# Altium project EL2086.PrjPcb (part 2 of 3)

## Sheet BOOT_JTAG_AUX.SchDoc: =project_title
size Tabloid; CompanyName: Luxonis Holding; DrawnBy: Eason Lin; Organization: Luxonis Holding; Address1: 1925 Harmony Park Drive; Address2: Westminster, CO; Address3: 80234; Address4: United States; DocumentNumber: D2088000; Revision: R0M0E0; SheetNumber: 7; SheetTotal: 14
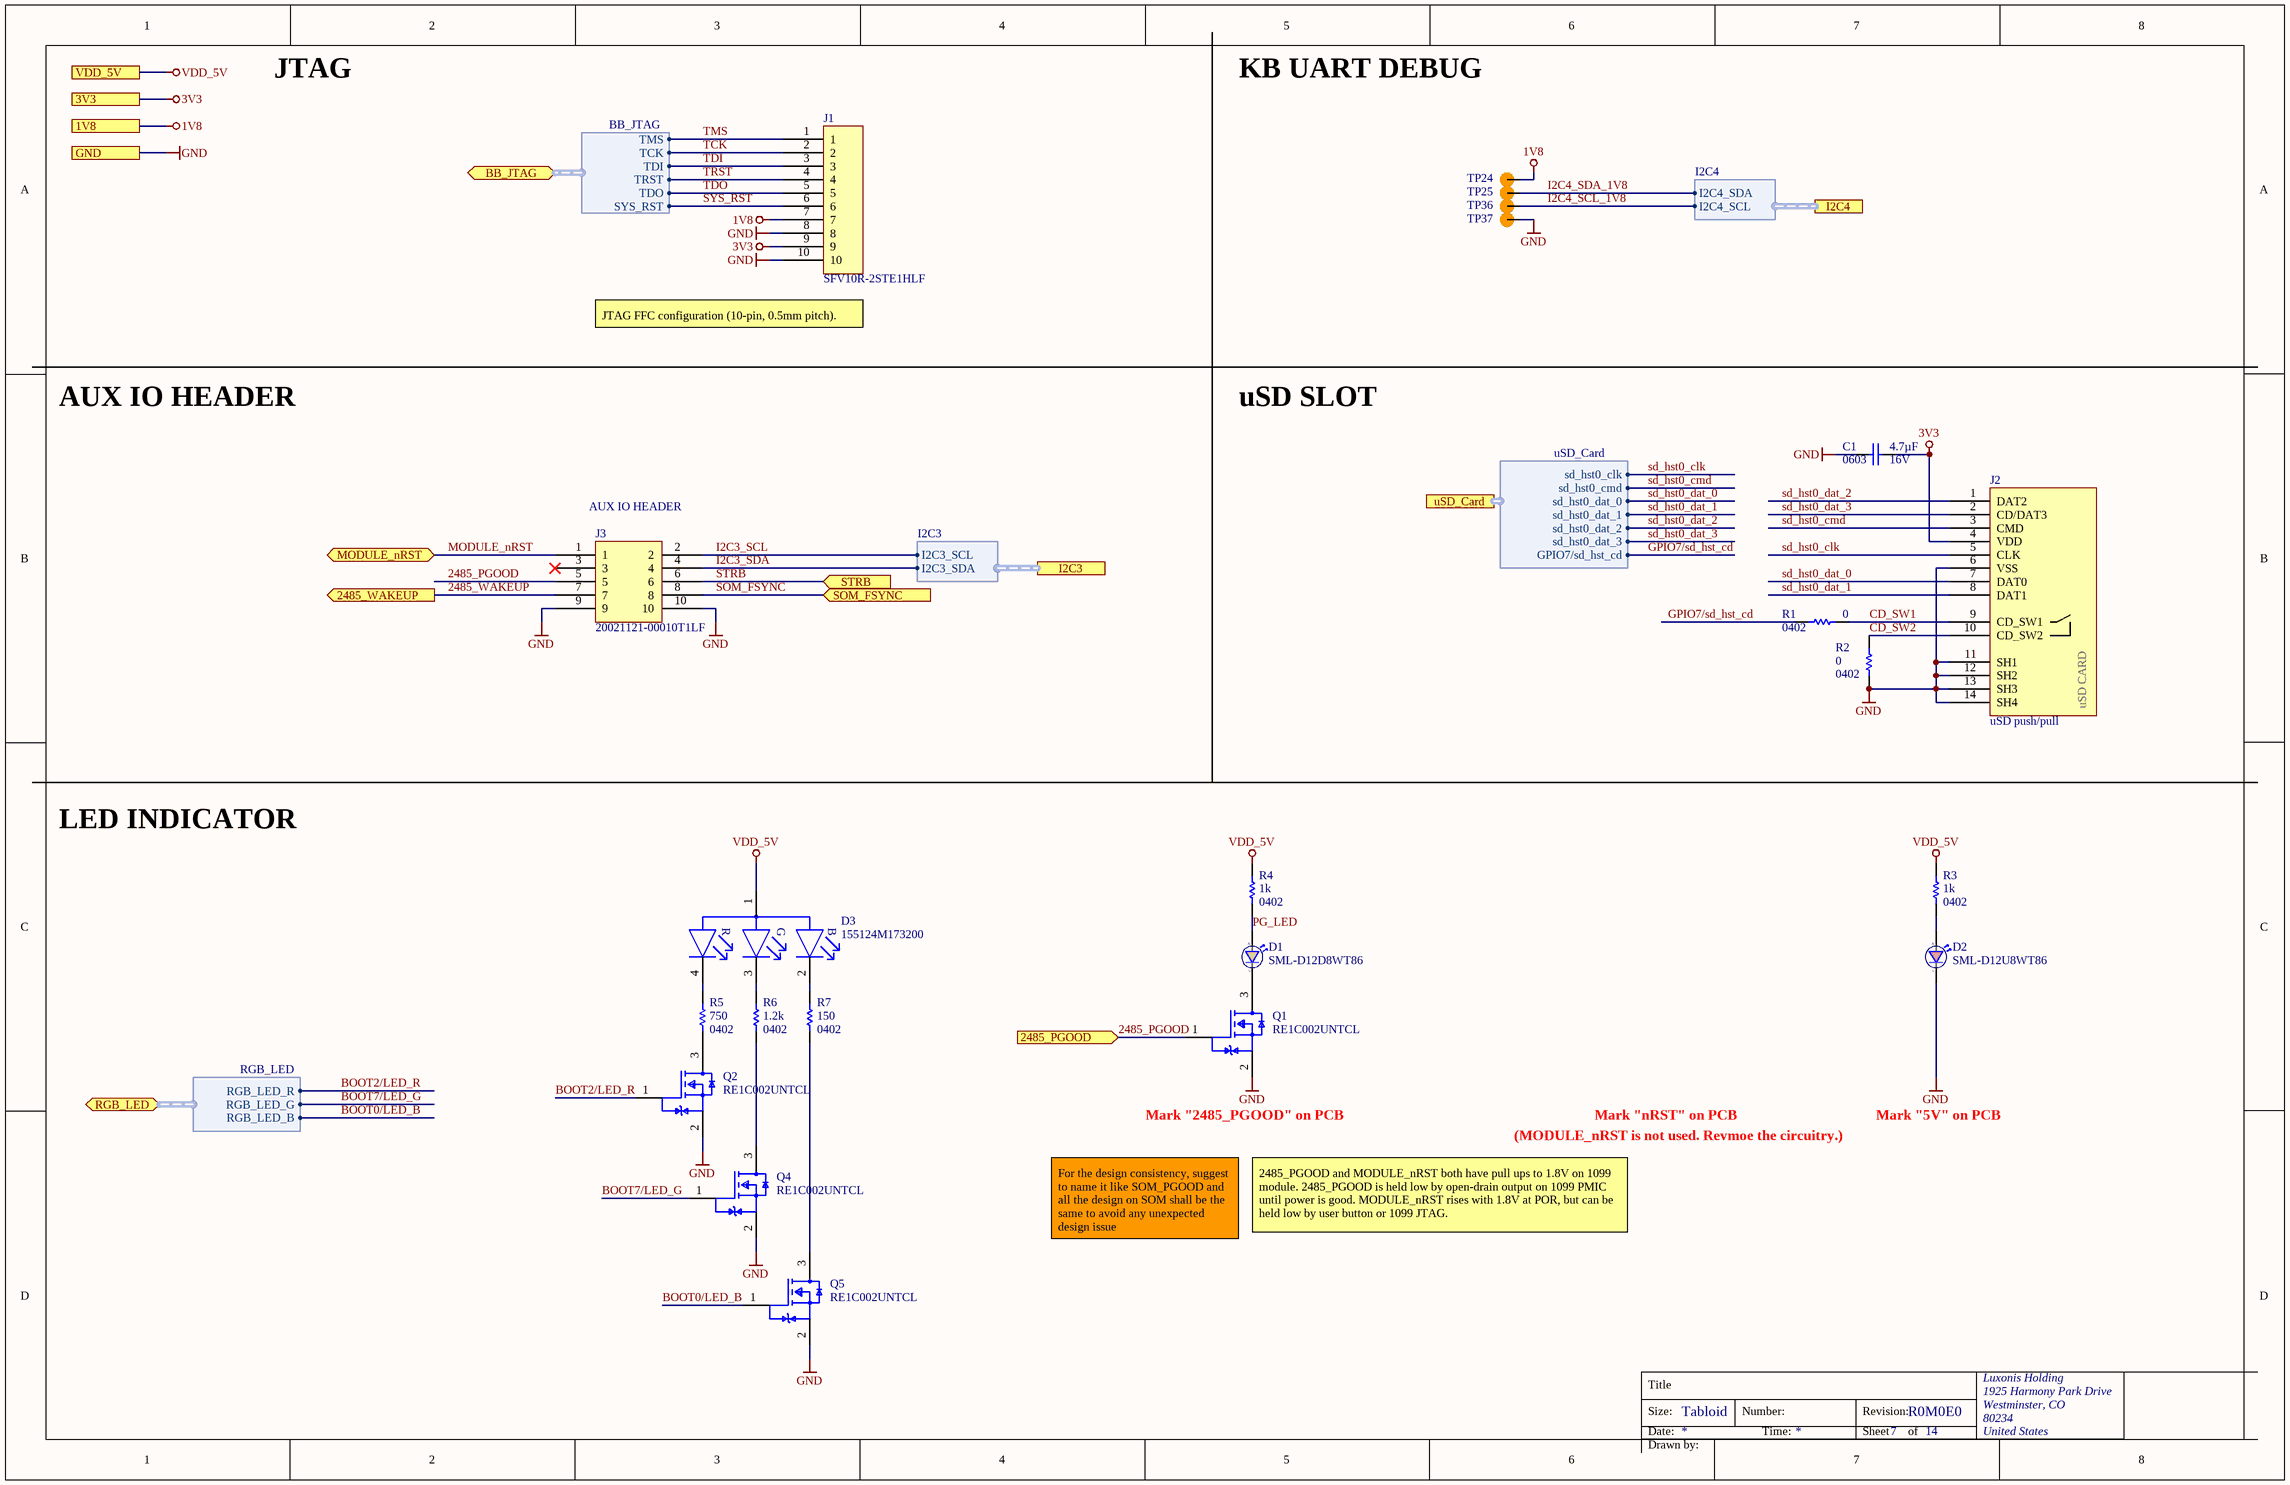
[diagram p5: BOOT_JTAG_AUX.SchDoc]

### Parts
C1  value 4.7µF  Voltage Rating: 16V  Case/Package: 0603  [CAPC0603(1608)100_N]  (hidden comment: GRM188R61C475KAAJD)
D1  SML-D12D8WT86  [SML_D1xx8W]
D2  SML-D12U8WT86  [SML_D1xx8W]
D3  155124M173200  [FP-155124M173200-MFG]
J1  SFV10R-2STE1HLF  [SFV10R-2STE1HLF]
J2  uSD push/pull  [104031-0811]
J3  20021121-00010T1LF  [20021121-00010T1LF]
Q1  RE1C002UNTCL  [RE1C002UNTCL]
Q2  RE1C002UNTCL  [RE1C002UNTCL]
Q4  RE1C002UNTCL  [RE1C002UNTCL]
Q5  RE1C002UNTCL  [RE1C002UNTCL]
R1  value 0  Case/Package: 0402  [RESC0402(1005)_L]  (hidden comment: CRCW04020000Z0ED)
R2  value 0  Case/Package: 0402  [RESC0402(1005)_L]  (hidden comment: CRCW04020000Z0ED)
R3  value 1k  Case/Package: 0402  [RESC0402(1005)_L]  (hidden comment: RC0402FR-071KL)
R4  value 1k  Case/Package: 0402  [RESC0402(1005)_L]  (hidden comment: RC0402FR-071KL)
R5  value 750  Case/Package: 0402  [RESC1005X40X25NL05T05]  (hidden comment: ERJ-2RKF7500X)
R6  value 1.2k  Case/Package: 0402  [RESC1005X40X25NL05T05]  (hidden comment: CRCW04021K20FKED)
R7  value 150  Case/Package: 0402  [RESC1005X40X25NL05T10]  (hidden comment: RC0402FR-07150RL)
TP24  TEST_POINT  [TP075_150_NS]  (value not drawn)  (no BOM)
TP25  TEST_POINT  [TP075_150_NS]  (value not drawn)  (no BOM)
TP36  TEST_POINT  [TP075_150_NS]  (value not drawn)  (no BOM)
TP37  TEST_POINT  [TP075_150_NS]  (value not drawn)  (no BOM)

### Ports
1V8, 3V3, 2485_PGOOD (in), 2485_WAKEUP (out), BB_JTAG (bidir, harness BB_JTAG), GND, I2C3 (harness I2C3), I2C4 (harness I2C4), MODULE_nRST (bidir), RGB_LED (bidir, harness RGB_LED), SOM_FSYNC (in), STRB (in), uSD_Card (harness uSD_Card), VDD_5V

### Harnesses
BB_JTAG: TMS, TCK, TDI, TRST, TDO, SYS_RST
I2C3: I2C3_SDA, I2C3_SCL
uSD_Card: sd_hst0_clk, sd_hst0_cmd, sd_hst0_dat_0, sd_hst0_dat_1, sd_hst0_dat_2, sd_hst0_dat_3, GPIO7/sd_hst_cd
RGB_LED: RGB_LED_G, RGB_LED_B, RGB_LED_R
I2C4: I2C4_SDA, I2C4_SCL

### Nets
1V8: J1.7 TP24.1 ; port 1V8
3V3: C1.1 J1.9 J2.4(VDD) ; port 3V3
GND: C1.2 D2.1(C) J1.8 J1.10 J2.6(VSS) J2.11(SH1) J2.12(SH2) J2.13(SH3) J2.14(SH4) J3.9 J3.10 Q1.2(Source) Q2.2(Source) Q4.2(Source) Q5.2(Source) R2.1 TP37.1 ; port GND
VDD_5V: D3.1(COMMON_ANODE) R3.2 R4.2 ; port VDD_5V
2485_PGOOD: J3.5 Q1.1(Gate) ; port 2485_PGOOD
2485_WAKEUP: J3.7 ; port 2485_WAKEUP
BOOT0/LED_B: Q5.1(Gate) ; port RGB_LED.RGB_LED_B
BOOT2/LED_R: Q2.1(Gate) ; port RGB_LED.RGB_LED_R
BOOT7/LED_G: Q4.1(Gate) ; port RGB_LED.RGB_LED_G
CD_SW1: J2.9(CD_SW1) R1.2
CD_SW2: J2.10(CD_SW2) R2.2
GPIO7/sd_hst_cd: R1.1 ; port uSD_Card.GPIO7/sd_hst_cd
I2C3_SCL: J3.2 ; port I2C3.I2C3_SCL
I2C3_SDA: J3.4 ; port I2C3.I2C3_SDA
I2C4_SCL_1V8: TP36.1 ; port I2C4.I2C4_SCL
I2C4_SDA_1V8: TP25.1 ; port I2C4.I2C4_SDA
MODULE_nRST: J3.1 ; port MODULE_nRST
PG_LED: D1.2(A) R4.1
sd_hst0_clk: J2.5(CLK) ; port uSD_Card.sd_hst0_clk
sd_hst0_cmd: J2.3(CMD) ; port uSD_Card.sd_hst0_cmd
sd_hst0_dat_0: J2.7(DAT0) ; port uSD_Card.sd_hst0_dat_0
sd_hst0_dat_1: J2.8(DAT1) ; port uSD_Card.sd_hst0_dat_1
sd_hst0_dat_2: J2.1(DAT2) ; port uSD_Card.sd_hst0_dat_2
sd_hst0_dat_3: J2.2(CD/DAT3) ; port uSD_Card.sd_hst0_dat_3
SOM_FSYNC: J3.8 ; port SOM_FSYNC
STRB: J3.6 ; port STRB
SYS_RST: J1.6 ; port BB_JTAG.SYS_RST
TCK: J1.2 ; port BB_JTAG.TCK
TDI: J1.3 ; port BB_JTAG.TDI
TDO: J1.5 ; port BB_JTAG.TDO
TMS: J1.1 ; port BB_JTAG.TMS
TRST: J1.4 ; port BB_JTAG.TRST
NetD1_1: D1.1(C) Q1.3(Drain)
NetD2_2: D2.2(A) R3.1
NetD3_2: D3.2(BLUE_C) R7.2
NetD3_3: D3.3(GREEN_C) R6.2
NetD3_4: D3.4(RED_C) R5.2
NetQ2_3: Q2.3(Drain) R5.1
NetQ4_3: Q4.3(Drain) R6.1
NetQ5_3: Q5.3(Drain) R7.1

Not connected (* = marked no-connect by the designer): J3 3*

### Notes on the sheet
- JTAG
- KB UART DEBUG
- (near J1) JTAG FFC configuration (10-pin, 0.5mm pitch).
- AUX IO HEADER
- uSD SLOT
- (near J3) AUX IO HEADER
- LED INDICATOR
- Mark "2485_PGOOD" on PCB
- (MODULE_nRST is not used. Revmoe the circuitry.)
- Mark "nRST" on PCB
- Mark "5V" on PCB
- For the design consistency, suggest to name it like SOM_PGOOD and all the design on SOM shall be the same to avoid any unexpected design issue
- 2485_PGOOD and MODULE_nRST both have pull ups to 1.8V on 1099 module. 2485_PGOOD is held low by open-drain output on 1099 PMIC until power is good. MODULE_nRST rises with 1.8V at POR, but can be held low by user button or 1099 JTAG.
- Title
- Size:
- Date:
- Tabloid
- Number:
- Time:
- Revision:
- Sheet
- of
- Drawn by:
- (in symbol 104031-0811) uSD CARD
- (in symbol CMP-007-00038-2) R; G; B

### Library data of the parts
C1 = CMP-004-000020-4: CAP CER 4.7UF 16V X5R 0603 10%; Manufacturer 1: Murata; Max Operating Temperature: 85°C; Dielectric: X5R; Design Item ID: GRM188R61C475KAAJD; Depth: 0.8mm; Width: 0.8mm; Manufacturer 2: Murata; Manufacturer Part Number 3: GRM188R61C475KAAJD; Manufacturer Part Number 2: GRM188R61C475KAAJD; ComponentLink1Description: https://datasheet.ciiva.com/14813/595grm188r61c475kaaj23-14813668.pdf?src-supplier=Arrow; ComponentLink1URL: https://datasheet.ciiva.com/14813/595grm188r61c475kaaj23-14813668.pdf?src-supplier=Arrow; Manufacturer Part Number 1: GRM188R61C475KAAJD; Manufacturer 3: Murata; Mounting Technology: SMT; Tolerance: 10%; Length: 1.6mm; Min Operating Temperature: -55°C; Height: 0.8mm
D1 = CMP-111-000003-2: LED ORANGE DIFFUSED 0603 SMD Orange 605nm LED Indication - Discrete 2.2V 0603 (1608 Metric); Manufacturer 1: Rohm; Forward Current: 20mA; Case/Package: 0603; Manufacturer Part Number 1: SML-D12D8WT86; Max Operating Temperature: 85°C; Forward Voltage: 2.2V; Min Operating Temperature: -40°C; Color: Orange
D2 = CMP-111-000005-2: LED RED DIFFUSED 0603 SMD Red 620nm LED Indication - Discrete 2.2V 0603 (1608 Metric); Manufacturer 1: Rohm; Forward Current: 20mA; Manufacturer Part Number 1: SML-D12U8WT86; Case/Package: 0603; Forward Voltage: 2.2V; Min Operating Temperature: -40°C; Color: Red; Max Operating Temperature: 85°C
D3 = CMP-007-00038-2: Triple Color LED; Manufacturer 1: Wurth Elektronik; Max Current Rating: 30mA; Viewing Angle: 120°; Colour: RGB; Forward Current: 20mA; Case/Package: 1204; Manufacturer Part Number 1: 155124M173200
J1 = CMP-005-000024-3: CONN FFC TOP 10POS 0.50MM R/A; Manufacturer 1: Amphenol FCI; Pitch: 0.5mm; Voltage Rating: 50V; Gender: Female; Orientation: Right Angle; Max Operating Temperature: 105°C; Min Operating Temperature: -55°C; Mount: Surface Mount; Manufacturer Part Number 1: SFV10R-2STE1HLF; Pins: 10
J2 = 104031-0811: CONN MICRO SD CARD PUSH-PULL R/A; Manufacturer 1: Molex; Manufacturer Part Number 1: 104031-0811; Supplier 1: Digi-Key; Stock 1: 19400; Pricing 1: 1=2.02000, 10=1.82900, 25=1.71680, 50=1.64220, 100=1.56760, 250=1.41828, 500=1.30630, 1000=1.11969 (USD); RoHS: Yes; Supplier 2: Newark; Supplier 3: Mouser; Supplier Part Number 1: WM6357CT-ND; Supplier Part Number 2: 99R5410; Supplier Part Number 3: 538-104031-0811
J3 = 20021121-00010T1LF: CONN HEADER SMD 10POS 1.27MM; Manufacturer 1: Amphenol FCI; Number of Contacts: 10; Contact Resistance: 30mR; Max Voltage Rating (AC): 125V; Connector Type: Male Pin; Row Spacing: 0.05inch; Supplier 1: Digi-Key; Manufacturer Part Number 1: 20021121-00010T1LF; Stock 1: 1465; Pricing 1: 1=0.77000, 10=0.71800, 100=0.55040, 500=0.47860, 1000=0.39485, 5000=0.34699, 10000=0.32306 (USD); RoHS: Yes; Mount: Surface Mount; Contact Plating: Gold; Color: Black; Contact Material: Copper Alloy; Housing Color: Black; Housing Material: Thermoplastic; Min Operating Temperature: -40°C; Max Operating Temperature: 85°C; Number of Rows: 2; Termination: Solder; Package Quantity: 93; Packaging: Rail/Tube; Number of Positions: 10; Orientation: Straight; Length: 6.35mm; Pitch: 1.27mm; Contact Mating Length: 0.12inch; Depth: 3.4mm; ComponentLink1URL: https://datasheet.ciiva.com/18659/20021121-18659066.pdf?src-supplier=Digi-Key; ComponentLink1Description: https://datasheet.ciiva.com/18659/20021121-18659066.pdf?src-supplier=Digi-Key; ComponentLink2URL: https://datasheet.ciiva.com/10033/20021121-10033582.pdf?src-supplier=Avnet; ComponentLink2Description: https://datasheet.ciiva.com/10033/20021121-10033582.pdf?src-supplier=Avnet; Supplier Part Number 1: 609-6529-ND; Supplier 2: Mouser; Supplier 3: TTI; Supplier Part Number 2: 649-200211210010T1LF; Supplier Part Number 3: 20021121-00010T1LF
Q1 Q2 Q4 Q5 = CMP-120-000001-2: MOSFET N-CH 20V 0.2A EMT3; Manufacturer 1: Rohm; Continuous Drain Current: 200mA; Case/Package: SOT-89; Manufacturer Part Number 1: RE1C002UNTCL; Design Item ID: RE1C002UNTCL; Max Drain to Source Voltage: 20V
R1 R2 = CMP-013-000022-11: as R17 on sheet CONNECTOR_B; Max Operating Temperature: 155°C; Manufacturer Part Number 1: CRCW04020000Z0ED; Tolerance: 5%; Min Operating Temperature: -55°C; Design Item ID: CRCW04020000Z0ED
R3 R4 = CMP-013-000004-10: RES SMD 1K OHM 1% 1/16W 0402; Manufacturer 1: Yageo; Power Rating: 62.5mW; Voltage Rating: 50V; Min Operating Temperature: -55°C; Design Item ID: RC0402FR-071KL; Tolerance: 1%; Max Operating Temperature: 155°C; Manufacturer Part Number 1: RC0402FR-071KL
R5 = CMP-009-00197-8: RES SMD 750 OHM 1% 0.1W 0402; Manufacturer 1: Panasonic; Power Rating: 100mW; Manufacturer Part Number 1: ERJ-2RKF7500X; Tolerance: 1%
R6 = CMP-009-00198-15: RES SMD 1.2K OHM 1% 0.063W 0402; Manufacturer 1: Vishay; Voltage Rating: 50V; Power Rating: 63mW; Manufacturer Part Number 1: CRCW04021K20FKED; Tolerance: 1%
R7 = CMP-009-00196-8: RES SMD 150 OHM 1% 1/16W 0402; Manufacturer 1: Yageo; Voltage Rating: 50V; Tolerance: 1%; Manufacturer Part Number 1: RC0402FR-07150RL
TP24 TP25 TP36 TP37 = CMP-015-000000-2: Manufacturer Part Number 1: /; Source: LuxonisMaster.SchLib; Design Item ID: TEST_POINT

## Sheet POWER_GEN.SchDoc: =project_title
size Tabloid; CompanyName: Luxonis Holding; DrawnBy: Eason Lin; Organization: Luxonis Holding; Address1: 1925 Harmony Park Drive; Address2: Westminster, CO; Address3: 80234; Address4: United States; DocumentNumber: D2088000; Revision: R0M0E0; SheetNumber: 4; SheetTotal: 14
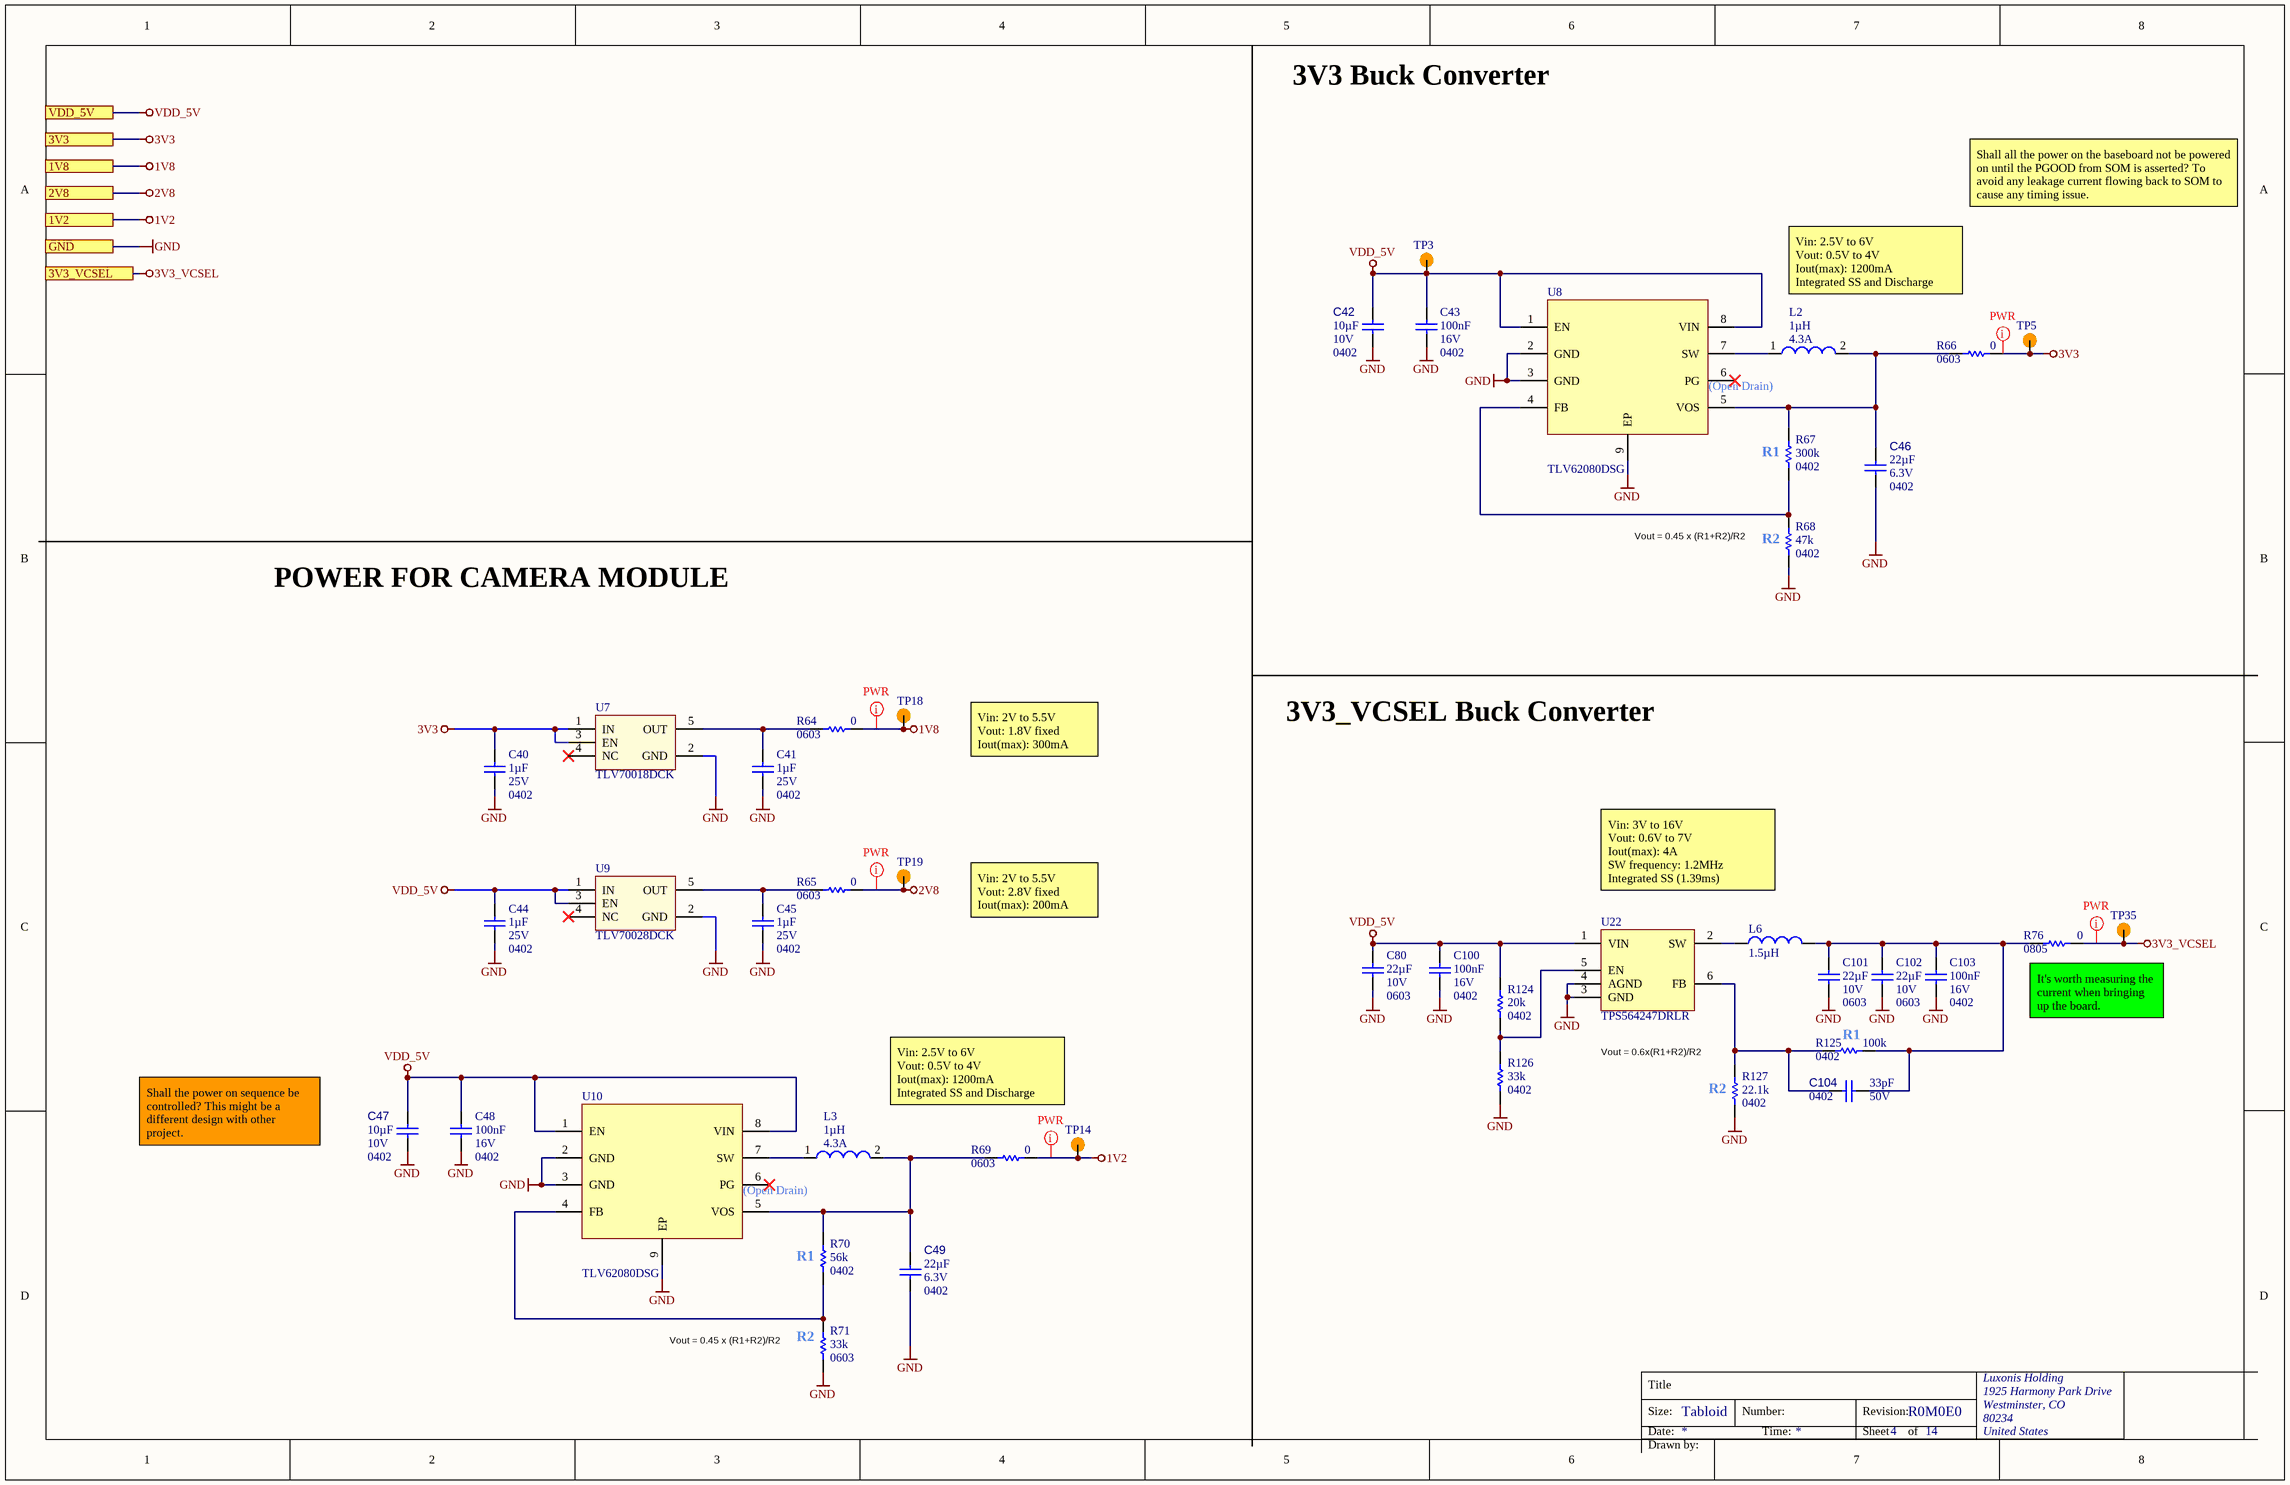
[diagram p6: POWER_GEN.SchDoc]

### Parts
C40  value 1µF  Voltage Rating: 25V  Case/Package: 0402  [CAPC0402(1005)70_N]  (hidden comment: GRM155R61E105KA12D)
C41  value 1µF  Voltage Rating: 25V  Case/Package: 0402  [CAPC0402(1005)70_N]  (hidden comment: GRM155R61E105KA12D)
C42  value 10µF  Voltage Rating: 10V  Case/Package: 0402  [CAPC0402(1005)60_L]  (hidden comment: GRM155R61A106ME11D)
C43  value 100nF  Voltage Rating: 16V  Case/Package: 0402  [CAPC0402(1005)60_N]  (hidden comment: CL05B104KO5NFNC)
C44  value 1µF  Voltage Rating: 25V  Case/Package: 0402  [CAPC0402(1005)70_N]  (hidden comment: GRM155R61E105KA12D)
C45  value 1µF  Voltage Rating: 25V  Case/Package: 0402  [CAPC0402(1005)70_N]  (hidden comment: GRM155R61E105KA12D)
C46  value 22µF  Voltage Rating: 6.3V  Case/Package: 0402  [CAPC0402(1005)60_L]  (hidden comment: CL05A226MQ5N6J8)
C47  value 10µF  Voltage Rating: 10V  Case/Package: 0402  [CAPC0402(1005)60_L]  (hidden comment: GRM155R61A106ME11D)
C48  value 100nF  Voltage Rating: 16V  Case/Package: 0402  [CAPC0402(1005)60_N]  (hidden comment: CL05B104KO5NFNC)
C49  value 22µF  Voltage Rating: 6.3V  Case/Package: 0402  [CAPC0402(1005)60_L]  (hidden comment: CL05A226MQ5N6J8)
C80  value 22µF  Voltage Rating: 10V  Case/Package: 0603  [CAPC0603(1608)100_N]  (hidden comment: GRM188R61A226ME15D)
C100  value 100nF  Voltage Rating: 16V  Case/Package: 0402  [CAPC0402(1005)60_N]  (hidden comment: CL05B104KO5NFNC)
C101  value 22µF  Voltage Rating: 10V  Case/Package: 0603  [CAPC0603(1608)100_N]  (hidden comment: GRM188R61A226ME15D)
C102  value 22µF  Voltage Rating: 10V  Case/Package: 0603  [CAPC0603(1608)100_N]  (hidden comment: GRM188R61A226ME15D)
C103  value 100nF  Voltage Rating: 16V  Case/Package: 0402  [CAPC0402(1005)60_N]  (hidden comment: CL05B104KO5NFNC)
C104  value 33pF  Voltage Rating: 50V  Case/Package: 0402  [FP-GCM155-0_05-IPC_A]  (hidden comment: GCM1555C1H330JA16D)
L2  value 1µH  Current Rating: 4.3A  [DFE252012P-1R0M=P2]  (hidden comment: DFE252012P-1R0M=P2)
L3  value 1µH  Current Rating: 4.3A  [DFE252012P-1R0M=P2]  (hidden comment: DFE252012P-1R0M=P2)
L6  value 1.5µH  [FP-SRP6540-MFG]  (hidden comment: SRP6540-1R5M)
R64  value 0  Case/Package: 0603  [RESC0603(1608)_N]  (hidden comment: CRCW06030000Z0EA)
R65  value 0  Case/Package: 0603  [RESC0603(1608)_N]  (hidden comment: CRCW06030000Z0EA)
R66  value 0  Case/Package: 0603  [RESC0603(1608)_N]  (hidden comment: CRCW06030000Z0EA)
R67  value 300k  Case/Package: 0402  [RESC0402(1005)_N]  (hidden comment: RC0402FR-07300KL)
R68  value 47k  Case/Package: 0402  [RESC0402(1005)_L]  (hidden comment: RC0402FR-0747KL)
R69  value 0  Case/Package: 0603  [RESC0603(1608)_N]  (hidden comment: CRCW06030000Z0EA)
R70  value 56k  Case/Package: 0402  [RESC0402(1005)_L]  (hidden comment: RC0402FR-0756KL)
R71  value 33k  Case/Package: 0603  [RESC1608X55X25LL10T15]  (hidden comment: RC0603FR-0733KL)
R76  value 0  Case/Package: 0805  [RESC0805(2012)_L]  (hidden comment: CRCW08050000Z0EA)
R124  value 20k  Case/Package: 0402  [RESC0402(1005)_L]  (hidden comment: RC0402FR-0720KL)
R125  value 100k  Case/Package: 0402  [RESC0402(1005)_L]  (hidden comment: RC0402FR-07100KL)
R126  value 33k  Case/Package: 0402  [RESC0402(1005)_L]  (hidden comment: CRCW040233K0FKED)
R127  value 22.1k  Case/Package: 0402  [RESC0402(1005)_N]  (hidden comment: RC0402FR-0722K1L)
TP3  TP075_150_NS  [TP075_150_NS]  (value not drawn)  (no BOM)
TP5  TP075_150_NS  [TP075_150_NS]  (value not drawn)  (no BOM)
TP14  TP075_150_NS  [TP075_150_NS]  (value not drawn)  (no BOM)
TP18  TP075_150_NS  [TP075_150_NS]  (value not drawn)  (no BOM)
TP19  TP075_150_NS  [TP075_150_NS]  (value not drawn)  (no BOM)
TP35  TP075_150_NS  [TP075_150_NS]  (value not drawn)  (no BOM)
U7  TLV70018DCK  [TLV70018DCK]
U8  TLV62080DSG  [TLV62080DSG]
U9  TLV70028DCK  [TLV70028DCK]
U10  TLV62080DSG  [TLV62080DSG]
U22  TPS564247DRLR  [TPS564247DRLR-Footprint-1]

### Ports
1V2, 1V8, 2V8, 3V3, 3V3_VCSEL, GND, VDD_5V

### Nets
1V2: R69.2 TP14.1 ; port 1V2
1V8: R64.2 TP18.1 ; port 1V8
2V8: R65.2 TP19.1 ; port 2V8
3V3: C40.2 R66.2 TP5.1 U7.1(IN) U7.3(EN) ; port 3V3
3V3_VCSEL: R76.2 TP35.1 ; port 3V3_VCSEL
GND: C40.1 C41.1 C42.1 C43.1 C44.1 C45.1 C46.1 C47.1 C48.1 C49.1 C80.1 C100.1 C101.1 C102.1 C103.1 R68.1 R71.1 R126.1 R127.1 U7.2(GND) U8.2(GND) U8.3(GND) U8.9(EP) U9.2(GND) U10.2(GND) U10.3(GND) U10.9(EP) U22.3(GND) U22.4(AGND) ; port GND
VDD_5V: C42.2 C43.2 C44.2 C47.2 C48.2 C80.2 C100.2 R124.2 TP3.1 U8.1(EN) U8.8(VIN) U9.1(IN) U9.3(EN) U10.1(EN) U10.8(VIN) U22.1(VIN) ; port VDD_5V
NetC41_2: C41.2 R64.1 U7.5(OUT)
NetC45_2: C45.2 R65.1 U9.5(OUT)
NetC46_2: C46.2 L2.2 R66.1 R67.2 U8.5(VOS)
NetC49_2: C49.2 L3.2 R69.1 R70.2 U10.5(VOS)
NetC101_2: C101.2 C102.2 C103.2 C104.1 L6.2 R76.1 R125.1
NetC104_2: C104.2 R125.2 R127.2 U22.6(FB)
NetL2_1: L2.1 U8.7(SW)
NetL3_1: L3.1 U10.7(SW)
NetL6_1: L6.1 U22.2(SW)
NetR67_1: R67.1 R68.2 U8.4(FB)
NetR70_1: R70.1 R71.2 U10.4(FB)
NetR124_1: R124.1 R126.2 U22.5(EN)

Not connected (* = marked no-connect by the designer): U7 4(NC)*; U8 6(PG)*; U9 4(NC)*; U10 6(PG)*

### Layout directives
net class PWR; Current Rating: 200mA: 1V8
net class PWR; Current Rating: 300mA: 2V8
net class PWR; Current Rating: 1200mA: 1V2, 3V3
net class PWR; Current Rating: 3A: 3V3_VCSEL

### Notes on the sheet
- 3V3 Buck Converter
- Shall all the power on the baseboard not be powered on until the PGOOD from SOM is asserted? To avoid any leakage current flowing back to SOM to cause any timing issue.
- Vin: 2.5V to 6V
  Vout: 0.5V to 4V
  Iout(max): 1200mA
  Integrated SS and Discharge
- (near U8) (Open Drain)
- (near R67) R1
- (near R68) Vout = 0.45 x (R1+R2)/R2
- (near R68) R2
- POWER FOR CAMERA MODULE
- Vin: 2V to 5.5V
  Vout: 1.8V fixed
  Iout(max): 300mA
- 3V3_VCSEL Buck Converter
- Vin: 3V to 16V
  Vout: 0.6V to 7V
  Iout(max): 4A
  SW frequency: 1.2MHz
  Integrated SS (1.39ms)
- Vin: 2V to 5.5V
  Vout: 2.8V fixed
  Iout(max): 200mA
- It's worth measuring the current when bringing up the board.
- (near R127) Vout = 0.6x(R1+R2)/R2
- (near R127) R2
- (near R125) R1
- Shall the power on sequence be controlled? This might be a different design with other project.
- (near U10) (Open Drain)
- (near R70) R1
- (near R71) Vout = 0.45 x (R1+R2)/R2
- (near R71) R2
- Title
- Size:
- Date:
- Tabloid
- Number:
- Time:
- Revision:
- Sheet
- of
- Drawn by:

### Library data of the parts
C40 C41 C44 C45 = CMP-108-000014-5: CAP CER 1UF 25V X5R 0402 10%; Manufacturer 1: Murata; ComponentLink2Description: https://datasheet.ciiva.com/7719/1666664-7719006.pdf?src-supplier=Element14; ComponentLink2URL: https://datasheet.ciiva.com/7719/1666664-7719006.pdf?src-supplier=Element14; Max Operating Temperature: 85°C; Depth: 0.5mm; Mounting Technology: SMT; ComponentLink1URL: https://datasheet.ciiva.com/22732/1666664-22732122.pdf?src-supplier=Element14; Length: 1mm; ComponentLink1Description: https://datasheet.ciiva.com/22732/1666664-22732122.pdf?src-supplier=Element14; Manufacturer Part Number 1: GRM155R61E105KA12D; Tolerance: 10%; Design Item ID: GRM155R61E105KA12D; Dielectric: X5R; Min Operating Temperature: -55°C; Height: 0.5mm; Width: 0.5mm
C42 C47 = CMP-001-00125-4: CAP CER 10UF 10V X5R 0402 20%; Manufacturer 1: Murata; Mounting Technology: SMT; Tolerance: 20%; Manufacturer Part Number 1: GRM155R61A106ME11D; Dielectric: X5R
C43 C48 C100 C103 = CMP-108-000002-6: CAP CER 0.1UF 16V X7R 0402 10%; Manufacturer 1: Samsung; ComponentLink1URL: https://datasheet.ciiva.com/25767/cl05b104ko5nfnc-25767124.pdf?src-supplier=Digi-Key; Length: 1mm; Design Item ID: CL05B104KO5NFNC; Tolerance: 10%; Min Operating Temperature: -55°C; Width: 0.02inch; Dielectric: X7R; ComponentLink1Description: https://datasheet.ciiva.com/25767/cl05b104ko5nfnc-25767124.pdf?src-supplier=Digi-Key; Height: 0.5mm; Depth: 0.5mm; Manufacturer Part Number 1: CL05B104KO5NFNC; Max Operating Temperature: 125°C; Mounting Technology: SMT
C46 C49 = CMP-001-00163-4: CAP CER 22UF 6.3V X5R 0402 20%; Manufacturer 1: Samsung; Manufacturer Part Number 1: CL05A226MQ5N6J8; Mounting Technology: Surface Mount; Tolerance: 20%
C80 C101 C102 = CMP-108-000020-4: CAP CER 22UF 10V X5R 0603 20%; Manufacturer 1: Murata; ComponentLink1Description: https://datasheet.ciiva.com/46444/1769893-46444975.pdf?src-supplier=Element14; ComponentLink1URL: https://datasheet.ciiva.com/46444/1769893-46444975.pdf?src-supplier=Element14; Mounting Technology: SMT; Width: 0.8mm; Length: 1.6mm; Height: 0.8mm; Design Item ID: GRM188R61A226ME15D; Manufacturer Part Number 1: GRM188R61A226ME15D; Depth: 0.8mm; Tolerance: 20%; Min Operating Temperature: -55°C; Dielectric: X5R; Max Operating Temperature: 85°C
C104 = CMP-001-00100-6: CAP CER 33pF 50V C0G 0402 5%; Manufacturer 1: Murata; Capacitor Type: Ceramic; Mounting Technology: SMT; Dielectric: C0G; Manufacturer Part Number 1: GCM1555C1H330JA16D; Tolerance: 5%
L2 L3 = CMP-082-000001-2: FIXED IND 1UH 3.2A 42 MOHM SMD; Manufacturer: Murata; Tolerance: 20%; Manufacturer Part Number: DFE252012P-1R0M=P2; Case/Package: 1008; Manufacturer 1: Murata; Manufacturer Part Number 1: DFE252012P-1R0M=P2; Manufacturer 2: Murata; Manufacturer Part Number 2: DFE252012P-1R0M=P2; Manufacturer 3: Murata; Manufacturer Part Number 3: DFE252012P-1R0M=P2; Manufacturer 4: Murata; Manufacturer Part Number 4: DFE252012P-1R0M=P2
L6 = CMP-006-00052-1: General Purpose Inductor, 1.5uH, 20%, 1 Element, Powdered Iron-Core, SMD, 2826; Manufacturer 1: Bourns; Saturation Current: 11A; Current Rating: 11A; Tolerance: 20%; Case/Package: 2826; Manufacturer Part Number 1: SRP6540-1R5M
R64-R66 R69 = CMP-115-000011-7: RES SMD 0 OHM 5% 1/10W 0603; Manufacturer 1: Vishay; Manufacturer Part Number 1: CRCW0603-0000Z0EA; Temperature Coefficient: 100ppm/°C; Power Rating: 100mW; Voltage Rating: 75V; Tolerance: 5%; Design Item ID: CRCW06030000Z0EA; Max Operating Temperature: 155°C; Min Operating Temperature: -55°C
R67 = CMP-013-000049-8: RES SMD 300K OHM 1% 1/16W 0402; Manufacturer 1: Yageo; Voltage Rating: 50V; Power Rating: 63mW; Tolerance: 1%; Design Item ID: RC0402FR-07300KL; Max Operating Temperature: 155°C; Manufacturer Part Number 1: RC0402FR-07300KL; Min Operating Temperature: -55°C
R68 = CMP-013-000015-9: RES SMD 47K OHM 1% 1/16W 0402; Manufacturer 1: Yageo; Power Rating: 62.5mW; Voltage Rating: 50V; Max Operating Temperature: 155°C; Tolerance: 1%; Min Operating Temperature: -55°C; Manufacturer Part Number 1: RC0402FR-0747KL; Design Item ID: RC0402FR-0747KL
R70 = CMP-013-000017-11: RES SMD 56K OHM 1% 1/16W 0402; Manufacturer 1: Yageo; Power Rating: 62.5mW; Voltage Rating: 50V; Manufacturer Part Number 1: RC0402FR-0756KL; Tolerance: 1%; Min Operating Temperature: -55°C; Max Operating Temperature: 155°C
R71 = CMP-009-00229-8: RES SMD 33K OHM 1% 0.1W 0603; Manufacturer 1: Yageo; Voltage Rating: 75V; Power Rating: 100mW; Mounting Technology: SMD; Tolerance: 1%; Pins: 2; Manufacturer Part Number 1: RC0603FR-0733KL
R76 = CMP-013-000034-9: RES SMD 0 OHM 1% 1/8W 0805; Manufacturer 1: Vishay; Power Rating: 125mW; Manufacturer Part Number 1: CRCW08050000Z0EA; Max Operating Temperature: 155°C; Min Operating Temperature: -55°C; Design Item ID: CRCW08050000Z0EA
R124 = CMP-013-000011-9: RES SMD 20K OHM 1% 1/16W 0402; Manufacturer 1: Yageo; Power Rating: 62.5mW; Voltage Rating: 50V; Max Operating Temperature: 155°C; Manufacturer Part Number 1: RC0402FR-0720KL; Min Operating Temperature: -55°C; Design Item ID: RC0402FR-0720KL; Tolerance: 1%
R125 = CMP-013-000035-8: RES SMD 100K OHM 1% 1/16W 0402; Manufacturer 1: Yageo; Power Rating: 63mW; Voltage Rating: 50V; Tolerance: 1%; Min Operating Temperature: -55°C; Max Operating Temperature: 155°C; Design Item ID: RC0402FR-07100KL; Manufacturer Part Number 1: RC0402FR-07100KL
R126 = CMP-013-000025-8: RES SMD 33K OHM 1% 1/16W 0402; Manufacturer 1: Vishay; Voltage Rating: 50V; Power Rating: 63mW; Tolerance: 1%; Max Operating Temperature: 155°C; Design Item ID: CRCW040233K0FKED; Manufacturer Part Number 1: CRCW040233K0FKED; Min Operating Temperature: -55°C
R127 = CMP-013-000045-8: RES SMD 22.1K OHM 1% 1/16W 0402; Manufacturer 1: Yageo; Power Rating: 62.5mW; Voltage Rating: 50V; Min Operating Temperature: -55°C; Max Operating Temperature: 155°C; Tolerance: 1%; Design Item ID: RC0402FR-0722K1L; Manufacturer Part Number 1: RC0402FR-0722K1L
TP3 TP5 TP14 TP18 TP19 TP35 = TEST_POINT
U7 = CMP-113-000003-2: IC REG LINEAR 1.8V 200MA SC70-5 Linear Voltage Regulator IC  1 Output  200mA SC-70-5; Manufacturer 1: Texas Instruments; Manufacturer Part Number 1: TLV70018DCKR; Max Supply Voltage: 5.5V; Min Supply Voltage: 2V; Min Operating Temperature: -40°C; Pins: 5; Max Output Voltage: 1.8V; Max Operating Temperature: 125°C; Case/Package: SC; Max Output Current: 200mA; Min Output Voltage: 1.8V
U8 U10 = CMP-010-000007-3: IC REG BUCK ADJ 1.2A SYNC 8WSON; Manufacturer Part Number 1: TLV62080DSGR; Manufacturer 1: Texas Instruments; Output Voltage: 4V; Min Output Voltage: 500mV; Max Supply Voltage: 5.5V; Min Supply Voltage: 2.5V; Vfb/Vout: 0V; Max Output Current: 1.2A; Max Operating Temperature: 125°C; Max Output Voltage: 4V; Min Operating Temperature: -40°C
U9 = CMP-055-000001-3: IC REG LINEAR 2.8V 200MA SC70-5 Linear Voltage Regulator IC  1 Output  200mA SC-70-5; Manufacturer 1: Texas Instruments; Manufacturer Part Number 1: TLV70028DCKT; Max Supply Voltage: 5.5V; Min Supply Voltage: 2V; Pins: 5; Max Operating Temperature: 125°C; Max Output Voltage: 2.8V; Min Operating Temperature: -40°C; Case/Package: SC; Min Output Voltage: 2.8V; Max Output Current: 200mA
U22 = CMP-019-00082-1: 3-V to 16-V input voltage, 4-A FCCM mode, synchronous buck converter in SOT-563 package 6-SOT-5X3 -40 to 125; Manufacturer 1: Texas Instruments; Frequency: 1.2MHz; Min Supply Voltage: 3V; Vfb/Vout: 650mV; Max Supply Voltage: 16V; Max Output Current: 4A; Min Operating Temperature: -40°C; Case/Package: SOT-563; Max Operating Temperature: 125°C; Manufacturer Part Number 1: TPS564247DRLR; Pins: 6

## Sheet TOF_VGA.SchDoc: =project_title
size Tabloid; CompanyName: Luxonis Holding; DrawnBy: Eason Lin; Organization: Luxonis Holding; Address1: 1925 Harmony Park Drive; Address2: Westminster, CO; Address3: 80234; Address4: United States; DocumentNumber: D2088000; Revision: R0M0E0; SheetNumber: 12; SheetTotal: 14
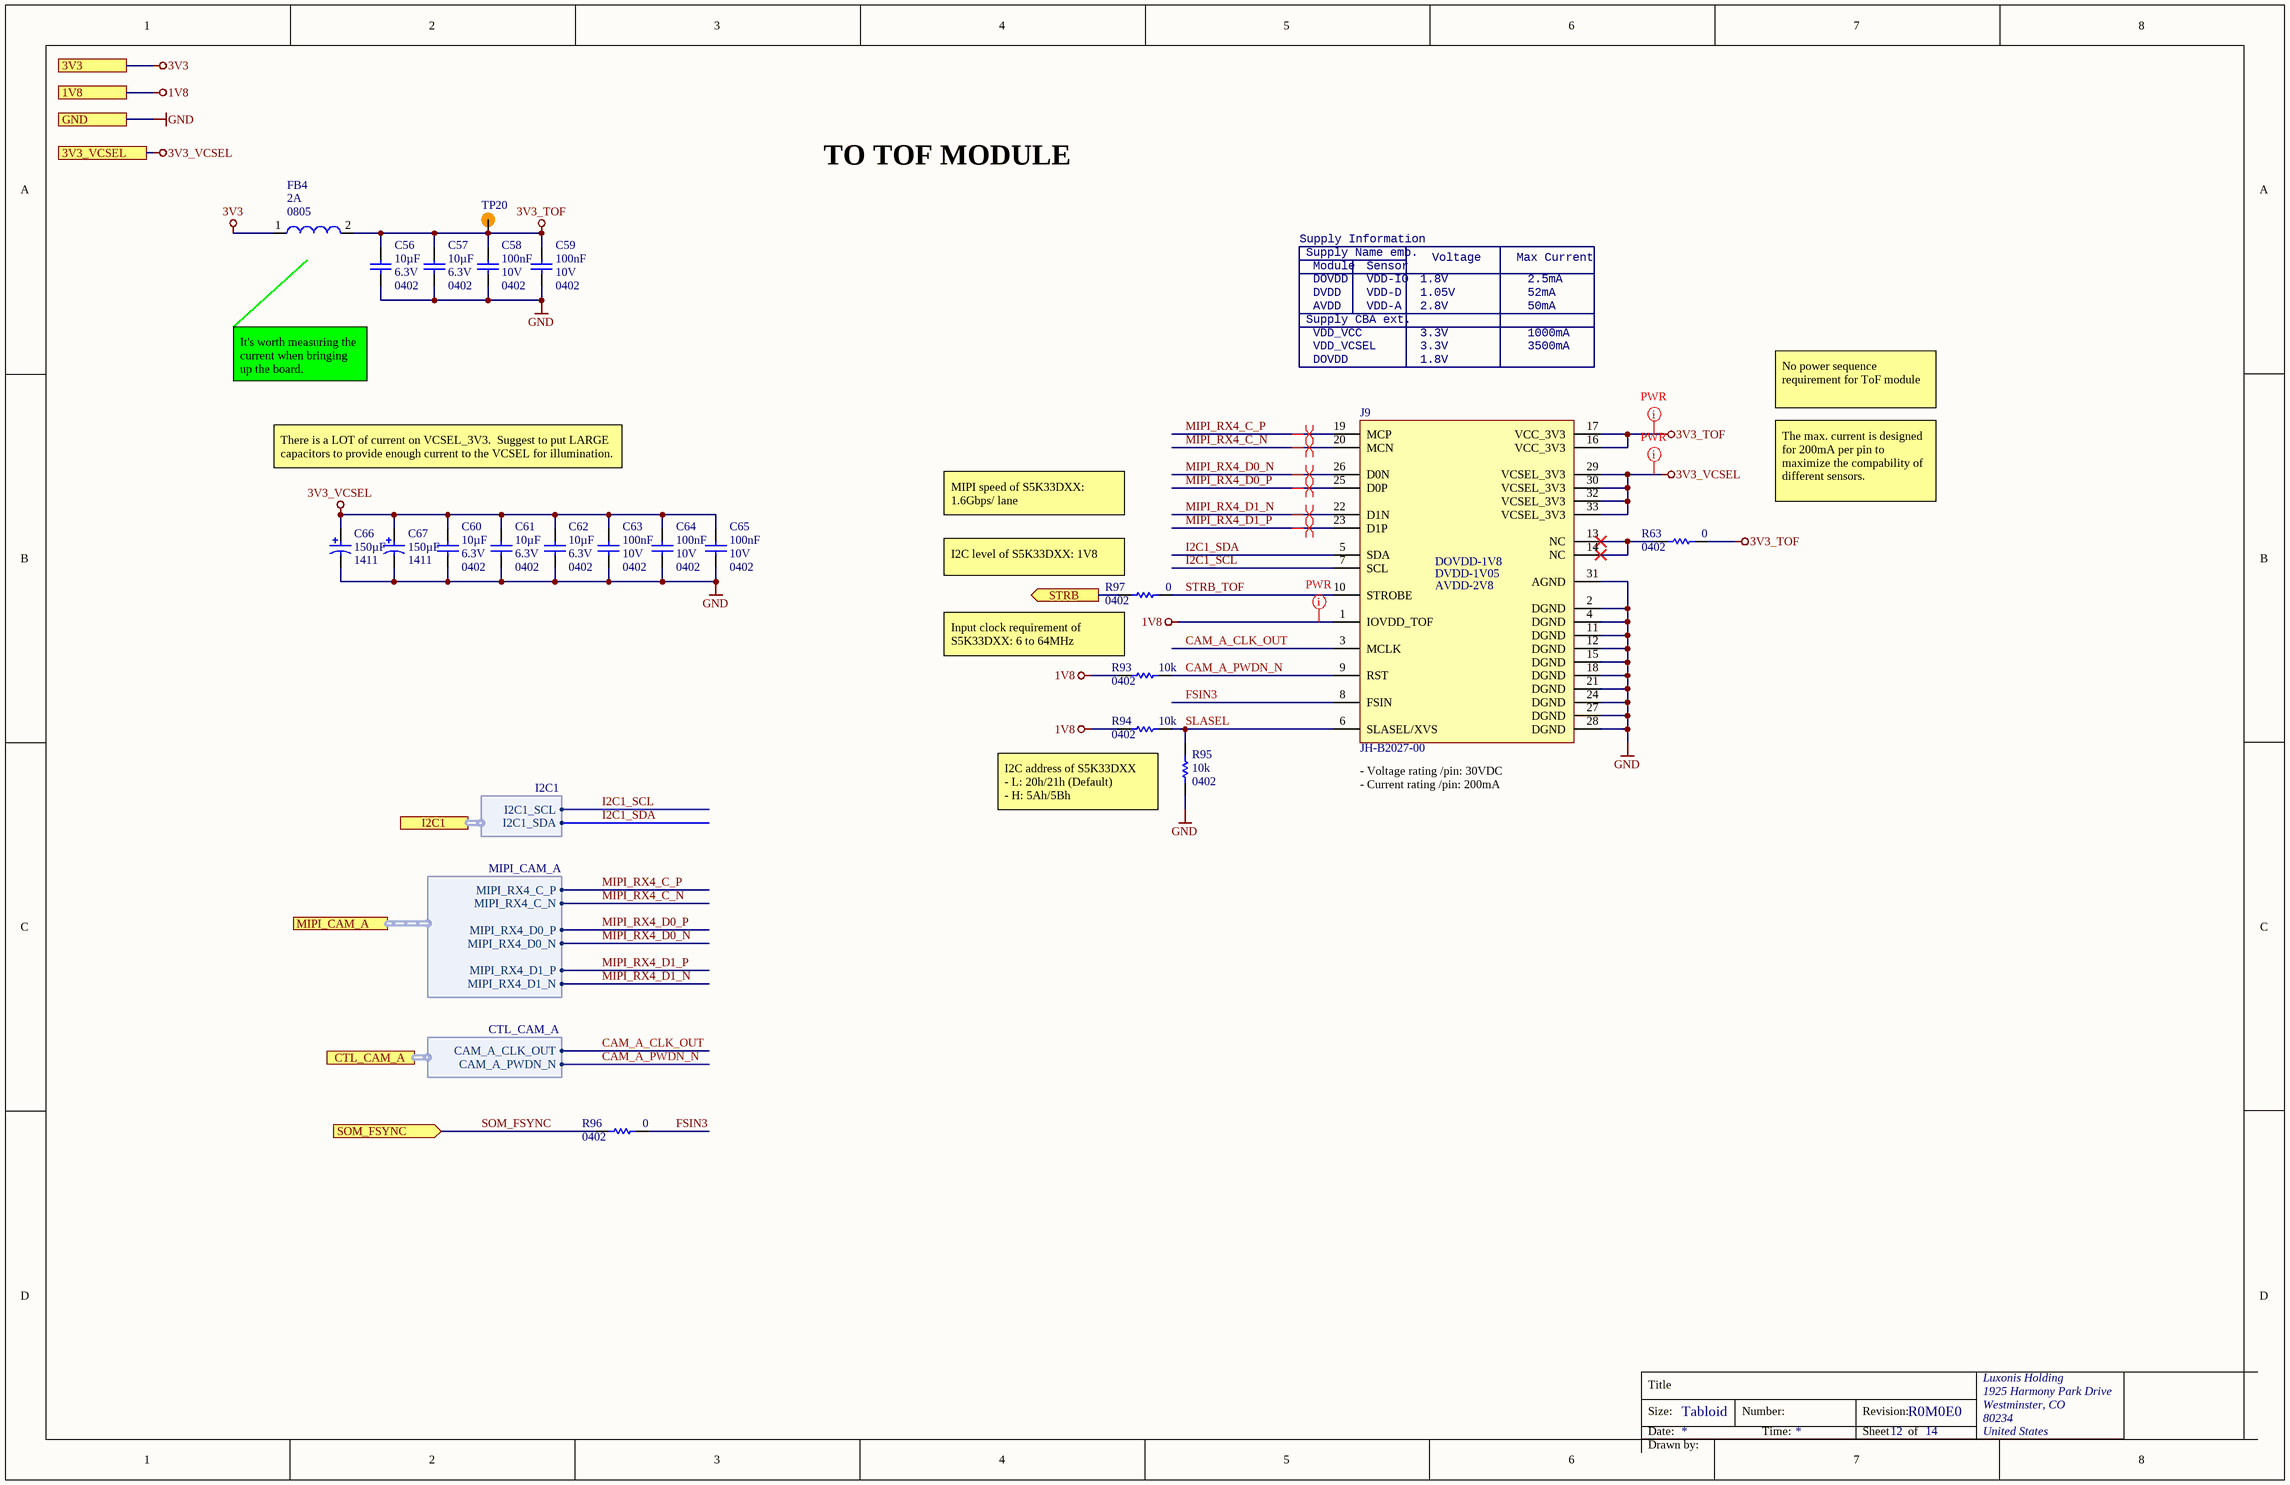
[diagram p7: TOF_VGA.SchDoc]

### Parts
C56  value 10µF  Case/Package: 0402  Voltage Rating: 6.3V  [CAPC0402(1005)70_N]  (hidden comment: GRM155R60J106ME15D)
C57  value 10µF  Case/Package: 0402  Voltage Rating: 6.3V  [CAPC0402(1005)70_N]  (hidden comment: GRM155R60J106ME15D)
C58  value 100nF  Voltage Rating: 10V  Case/Package: 0402  [CAPC0402(1005)70_N]  (hidden comment: GRM155R71A104JA01D)
C59  value 100nF  Voltage Rating: 10V  Case/Package: 0402  [CAPC0402(1005)70_N]  (hidden comment: GRM155R71A104JA01D)
C60  value 10µF  Case/Package: 0402  Voltage Rating: 6.3V  [CAPC0402(1005)70_N]  (hidden comment: GRM155R60J106ME15D)
C61  value 10µF  Case/Package: 0402  Voltage Rating: 6.3V  [CAPC0402(1005)70_N]  (hidden comment: GRM155R60J106ME15D)
C62  value 10µF  Case/Package: 0402  Voltage Rating: 6.3V  [CAPC0402(1005)70_N]  (hidden comment: GRM155R60J106ME15D)
C63  value 100nF  Voltage Rating: 10V  Case/Package: 0402  [CAPC0402(1005)70_N]  (hidden comment: GRM155R71A104JA01D)
C64  value 100nF  Voltage Rating: 10V  Case/Package: 0402  [CAPC0402(1005)70_N]  (hidden comment: GRM155R71A104JA01D)
C65  value 100nF  Voltage Rating: 10V  Case/Package: 0402  [CAPC0402(1005)70_N]  (hidden comment: GRM155R71A104JA01D)
C66  value 150µF  Case/Package: 1411  [RESTL1210(3225)_L]  (hidden comment: TLJB157M010R0500)
C67  value 150µF  Case/Package: 1411  [RESTL1210(3225)_L]  (hidden comment: TLJB157M010R0500)
FB4  Case/Package: 0805  Current Rating: 2A  [2508056017Y2]  (hidden comment: 2508056017Y2)
J9  JH-B2027-00  [PCBComponent_1]
R63  value 0  Case/Package: 0402  [RESC0402(1005)_L]  (hidden comment: CRCW04020000Z0ED)
R93  value 10k  Case/Package: 0402  [RESC0402(1005)_N]  (hidden comment: RC0402FR-1310KL)
R94  value 10k  Case/Package: 0402  [RESC0402(1005)_N]  (hidden comment: RC0402FR-1310KL)
R95  value 10k  Case/Package: 0402  [RESC0402(1005)_N]  (hidden comment: RC0402FR-1310KL)
R96  value 0  Case/Package: 0402  [RESC0402(1005)_L]  (hidden comment: CRCW04020000Z0ED)
R97  value 0  Case/Package: 0402  [RESC0402(1005)_L]  (hidden comment: CRCW04020000Z0ED)
TP20  TEST_POINT  [TP075_150_NS]  (value not drawn)  (no BOM)

### Ports
1V8, 3V3, 3V3_VCSEL, CTL_CAM_A (harness CTL_CAM_A), GND, I2C1 (harness I2C1), MIPI_CAM_A (harness MIPI_CAM_A), SOM_FSYNC (in), STRB (out)

### Harnesses
CTL_CAM_A: CAM_A_PWDN_N, CAM_A_CLK_OUT
MIPI_CAM_A: MIPI_RX4_C_P, MIPI_RX4_C_N, MIPI_RX4_D0_P, MIPI_RX4_D0_N, MIPI_RX4_D1_P, MIPI_RX4_D1_N
I2C1: I2C1_SDA, I2C1_SCL

### Nets
1V8: J9.1(IOVDD_TOF) R93.1 R94.1 ; port 1V8
3V3: FB4.1 ; port 3V3
3V3_TOF: C56.2 C57.2 C58.2 C59.2 FB4.2 J9.16(VCC_3V3) J9.17(VCC_3V3) R63.1 TP20.1
3V3_VCSEL: C60.2 C61.2 C62.2 C63.2 C64.2 C65.2 C66.1 C67.1 J9.29(VCSEL_3V3) J9.30(VCSEL_3V3) J9.32(VCSEL_3V3) J9.33(VCSEL_3V3) ; port 3V3_VCSEL
GND: C56.1 C57.1 C58.1 C59.1 C60.1 C61.1 C62.1 C63.1 C64.1 C65.1 C66.2 C67.2 J9.2(DGND) J9.4(DGND) J9.11(DGND) J9.12(DGND) J9.15(DGND) J9.18(DGND) J9.21(DGND) J9.24(DGND) J9.27(DGND) J9.28(DGND) J9.31(AGND) R95.1 ; port GND
CAM_A_CLK_OUT: J9.3(MCLK) ; port CTL_CAM_A.CAM_A_CLK_OUT
CAM_A_PWDN_N: J9.9(RST) R93.2 ; port CTL_CAM_A.CAM_A_PWDN_N
FSIN3: J9.8(FSIN) R96.1
I2C1_SCL: J9.7(SCL) ; port I2C1.I2C1_SCL
I2C1_SDA: J9.5(SDA) ; port I2C1.I2C1_SDA
MIPI_RX4_C_N: J9.20(MCN) ; port MIPI_CAM_A.MIPI_RX4_C_N
MIPI_RX4_C_P: J9.19(MCP) ; port MIPI_CAM_A.MIPI_RX4_C_P
MIPI_RX4_D0_N: J9.26(D0N) ; port MIPI_CAM_A.MIPI_RX4_D0_N
MIPI_RX4_D0_P: J9.25(D0P) ; port MIPI_CAM_A.MIPI_RX4_D0_P
MIPI_RX4_D1_N: J9.22(D1N) ; port MIPI_CAM_A.MIPI_RX4_D1_N
MIPI_RX4_D1_P: J9.23(D1P) ; port MIPI_CAM_A.MIPI_RX4_D1_P
SLASEL: J9.6(SLASEL/XVS) R94.2 R95.2
SOM_FSYNC: R96.2 ; port SOM_FSYNC
STRB: R97.2 ; port STRB
STRB_TOF: J9.10(STROBE) R97.1
NetJ9_13: J9.13(NC) J9.14(NC) R63.2

### Layout directives
differential pair; net class MIPI; differential pair class 100ohm: MIPI_RX4_C_N, MIPI_RX4_C_P, MIPI_RX4_D0_N, MIPI_RX4_D0_P, MIPI_RX4_D1_N, MIPI_RX4_D1_P
net class PWR; Current Rating: 3A: 3V3_VCSEL
net class PWR; Current Rating: 1A: 3V3_TOF
net class PWR; Current Rating: 200mA: 1V8

### Notes on the sheet
- TO TOF MODULE
- Supply Information
- Supply Name emb.
- DOVDD
- DVDD
- Module
- VDD-IO
- VDD-D
- Sensor
- 1.8V
- 1.05V
- Voltage
- Max Current
- 2.5mA
- 52mA
- Supply CBA ext.
- AVDD
- VDD_VCSEL
- VDD_VCC
- VDD-A
- 2.8V
- 3.3V
- 50mA
- 1000mA
- 3500mA
- It's worth measuring the current when bringing up the board.
- No power sequence requirement for ToF module
- There is a LOT of current on VCSEL_3V3.  Suggest to put LARGE capacitors to provide enough current to the VCSEL for illumination.
- The max. current is designed for 200mA per pin to maximize the compability of different sensors.
- (near R97) I2C level of S5K33DXX: 1V8
- MIPI speed of S5K33DXX: 1.6Gbps/ lane
- Input clock requirement of S5K33DXX: 6 to 64MHz
- I2C address of S5K33DXX
  - L: 20h/21h (Default)
  - H: 5Ah/5Bh
- (near J9) - Voltage rating /pin: 30VDC
  - Current rating /pin: 200mA
- Title
- Size:
- Date:
- Tabloid
- Number:
- Time:
- Revision:
- Sheet
- of
- Drawn by:
- (in symbol CMP-002-00132-2) DOVDD-1V8; DVDD-1V05; AVDD-2V8

### Library data of the parts
C56 C57 C60-C62 = CMP-004-000009-5: CAP CER 10UF 6.3V X5R 0402 20%; Manufacturer 1: Murata; Manufacturer Part Number 1: GRM155R60J106ME15D; Min Operating Temperature: -55°C; Max Operating Temperature: 85°C; Dielectric: X5R; Length: 0.039inch; Width: 0.02inch; ComponentLink1URL: https://www.murata.com/~/media/webrenewal/support/library/catalog/products/capacitor/mlcc/c02e.ashx?la=en-us&src-supplier=Digi-Key; ComponentLink1Description: https://www.murata.com/~/media/webrenewal/support/library/catalog/products/capacitor/mlcc/c02e.ashx?la=en-us&src-supplier=Digi-Key; Tolerance: 20%; Design Item ID: GRM155R60J106ME15D; Mounting Technology: SMT
C58 C59 C63-C65 = CMP-108-000015-5: CAP CER 0.1UF 10V X7R 0402 5%; Manufacturer 1: Murata; Dielectric: X7R; Tolerance: 5%; Min Operating Temperature: -55°C; Mounting Technology: SMT; Max Operating Temperature: 125°C; Depth: 0.5mm; Height: 0.5mm; ComponentLink2Description: https://datasheet.ciiva.com/11618/c02e-11618821.pdf?src-supplier=Avnet; Length: 1mm; Width: 0.02inch; ComponentLink1URL: https://datasheet.ciiva.com/5411/product-5411135.pdf?src-supplier=Mouser; Design Item ID: GRM155R71A104JA01D; ComponentLink1Description: https://datasheet.ciiva.com/5411/product-5411135.pdf?src-supplier=Mouser; Manufacturer Part Number 1: GRM155R71A104JA01D; ComponentLink2URL: https://datasheet.ciiva.com/11618/c02e-11618821.pdf?src-supplier=Avnet
C66 C67 = CMP-050-000000-4: CAP TAL 150UF 10V 20%; Manufacturer 1: Kyocera AVX; Capacitor Type: Tantalum; Polarity: Polarized; ComponentLink5Description: https://datasheet.ciiva.com/46385/1910903-46385237.pdf?src-supplier=Element14; Manufacturer Part Number 1: TLJB157M010R0500; Min Operating Temperature: -55°C; ComponentLink6Description: https://datasheet.ciiva.com/28515/tlj-28515528.pdf?src-supplier=Element14; ComponentLink4URL: https://datasheet.ciiva.com/264/tlj-264788.pdf?src-supplier=Digi-Key; ComponentLink5URL: https://datasheet.ciiva.com/46385/1910903-46385237.pdf?src-supplier=Element14; Length: 3.5mm; ComponentLink2URL: https://datasheet.ciiva.com/264/tlj-264786.pdf?src-supplier=Digi-Key; ComponentLink10URL: https://datasheet.ciiva.com/7773/1533257-7773834.pdf?src-supplier=Element14; ComponentLink11URL: https://datasheet.ciiva.com/11229/tlj-11229389.pdf?src-supplier=Avnet; Design Item ID: TLJB157M010R0500; ComponentLink10Description: https://datasheet.ciiva.com/7773/1533257-7773834.pdf?src-supplier=Element14; ComponentLink11Description: https://datasheet.ciiva.com/11229/tlj-11229389.pdf?src-supplier=Avnet; ComponentLink12URL: https://datasheet.ciiva.com/17339/tlj-17339422.pdf?src-supplier=Avnet+Europe; Mounting Technology: SMT; ComponentLink3URL: https://datasheet.ciiva.com/264/tlj-264787.pdf?src-supplier=Digi-Key; ComponentLink1Description: https://datasheet.ciiva.com:443/pdfs/VipMasterIC/IC/AVXC/AVXC-S-A0008508048/AVXC-S-A0008508048-1.pdf?src-supplier=IHS+Markit; ComponentLink12Description: https://datasheet.ciiva.com/17339/tlj-17339422.pdf?src-supplier=Avnet+Europe; ComponentLink7Description: https://datasheet.ciiva.com/7773/1533257-7773833.pdf?src-supplier=Element14; ComponentLink3Description: https://datasheet.ciiva.com/264/tlj-264787.pdf?src-supplier=Digi-Key; Max Operating Temperature: 125°C; Voltage Rating: 10V; ComponentLink8Description: https://datasheet.ciiva.com/14593/70001364-14593673.pdf?src-supplier=Allied+Electronics; Width: 2.8mm; ComponentLink2Description: https://datasheet.ciiva.com/264/tlj-264786.pdf?src-supplier=Digi-Key; ComponentLink7URL: https://datasheet.ciiva.com/7773/1533257-7773833.pdf?src-supplier=Element14; ComponentLink9URL: https://datasheet.ciiva.com/14606/70001364-14606409.pdf?src-supplier=Allied+Electronics; ComponentLink6URL: https://datasheet.ciiva.com/28515/tlj-28515528.pdf?src-supplier=Element14; ComponentLink4Description: https://datasheet.ciiva.com/264/tlj-264788.pdf?src-supplier=Digi-Key; ComponentLink9Description: https://datasheet.ciiva.com/14606/70001364-14606409.pdf?src-supplier=Allied+Electronics; ComponentLink8URL: https://datasheet.ciiva.com/14593/70001364-14593673.pdf?src-supplier=Allied+Electronics; ComponentLink1URL: https://datasheet.ciiva.com:443/pdfs/VipMasterIC/IC/AVXC/AVXC-S-A0008508048/AVXC-S-A0008508048-1.pdf?src-supplier=IHS+Markit; Height: 1.9mm; Tolerance: 20%
FB4 = CMP-082-000000-2: FERRITE BEAD, 0.1OHM, 2A, 0805, 600R/100MHz; Manufacturer 1: Fair-Rite; Tolerance: 25%; Manufacturer Part Number 1: 2508056017Y2
J9 = CMP-002-00132-2: FFC/FPC Connector, 33 Contact(s), 1 Row(s), Female, Right Angle, Surface Mount Terminal; Manufacturer 1: Hirose; Manufacturer Part Number 1: FH26W-33S-0.3SHW(60); ComponentLink1URL: https://datasheet.ciiva.com:443/pdfs/VipMasterIC/IC/HIRO/HIRO-S-A0007913874/HIRO-S-A0008593114-1.pdf?src-supplier=IHS+Markit; Design Item ID: AC_PY004-IMX378_CON; Category: FFC / FPC; ComponentLink2Description: https://www.hirose.com/product/en/download_file/key_name/FH26/category/Catalog/doc_file_id/49355/?file_category_id=4&item_id=298&is_series=1&src-supplier=Digi-Key; Pricing 1: 1=1,78000, 10=1,61700, 25=1,51800, 50=1,45200, 100=1,38600, 250=1,25400, 500=1,15500, 1000=0,99000, 2500=0,92400 (USD); Source: LuxonisMaster.SchLib; ComponentLink3URL: https://www.hirose.com/product/download/?distributor=digikey&amp;type=2d&amp;lang=en&amp;num=FH26W-13S-0.3SHW(60)&src-supplier=Digi-Key; ComponentLink1Description: https://datasheet.ciiva.com:443/pdfs/VipMasterIC/IC/HIRO/HIRO-S-A0007913874/HIRO-S-A0008593114-1.pdf?src-supplier=IHS+Markit; Pins: 33; Stock 1: 627; ComponentLink2URL: https://www.hirose.com/product/en/download_file/key_name/FH26/category/Catalog/doc_file_id/49355/?file_category_id=4&item_id=298&is_series=1&src-supplier=Digi-Key; ComponentLink3Description: https://www.hirose.com/product/download/?distributor=digikey&amp;type=2d&amp;lang=en&amp;num=FH26W-13S-0.3SHW(60)&src-supplier=Digi-Key; RoHS: Yes
R63 R96 R97 = CMP-013-000022-11: RES SMD 0 OHM 5% 1/16W 0402; Manufacturer 1: Vishay; Voltage Rating: 50V; Power Rating: 63mW; Max Operating Temperature: 155°C; Manufacturer Part Number 1: CRCW04020000Z0ED; Tolerance: 5%; Min Operating Temperature: -55°C; Design Item ID: CRCW04020000Z0ED
R93-R95 = CMP-115-000004-8: RES SMD 10K OHM 1% 1/16W 0402; Manufacturer 1: Yageo; Power Rating: 62.5mW; Temperature Coefficient: 100ppm/°C; Voltage Rating: 50V; Min Operating Temperature: -55°C; Max Operating Temperature: 155°C; Design Item ID: RC0402FR-1310KL; Tolerance: 1%; Manufacturer Part Number 1: RC0402FR-1310KL
TP20 = CMP-015-000000-2: Manufacturer Part Number 1: /; Source: LuxonisMaster.SchLib; Design Item ID: TEST_POINT

## Sheet RIGHT_CCM.SchDoc: =project_title
size Tabloid; PageSetup: Record=PageOptions|CenterHorizontal=True|CenterVertical=True|PrintScale=0.71|XCorrection=1.00|YCorrection=1.00|PrintKind=0|BorderSize=5000000|LeftOffset=0|BottomOffset=0|Orientation=2|PaperLength=1000|PaperWidth=1000|Scale=100|PaperSource=7|PrintQuality=-4|MediaType=1|DitherType=10|PrintScaleMode=1|PaperKind=A4; CompanyName: Luxonis Holding; DrawnBy: Eason Lin; Organization: Luxonis Holding; Address1: 1925 Harmony Park Drive; Address2: Westminster, CO; Address3: 80234; Address4: United States; DocumentNumber: D2088000; Revision: R0M0E0; SheetNumber: 11; SheetTotal: 14
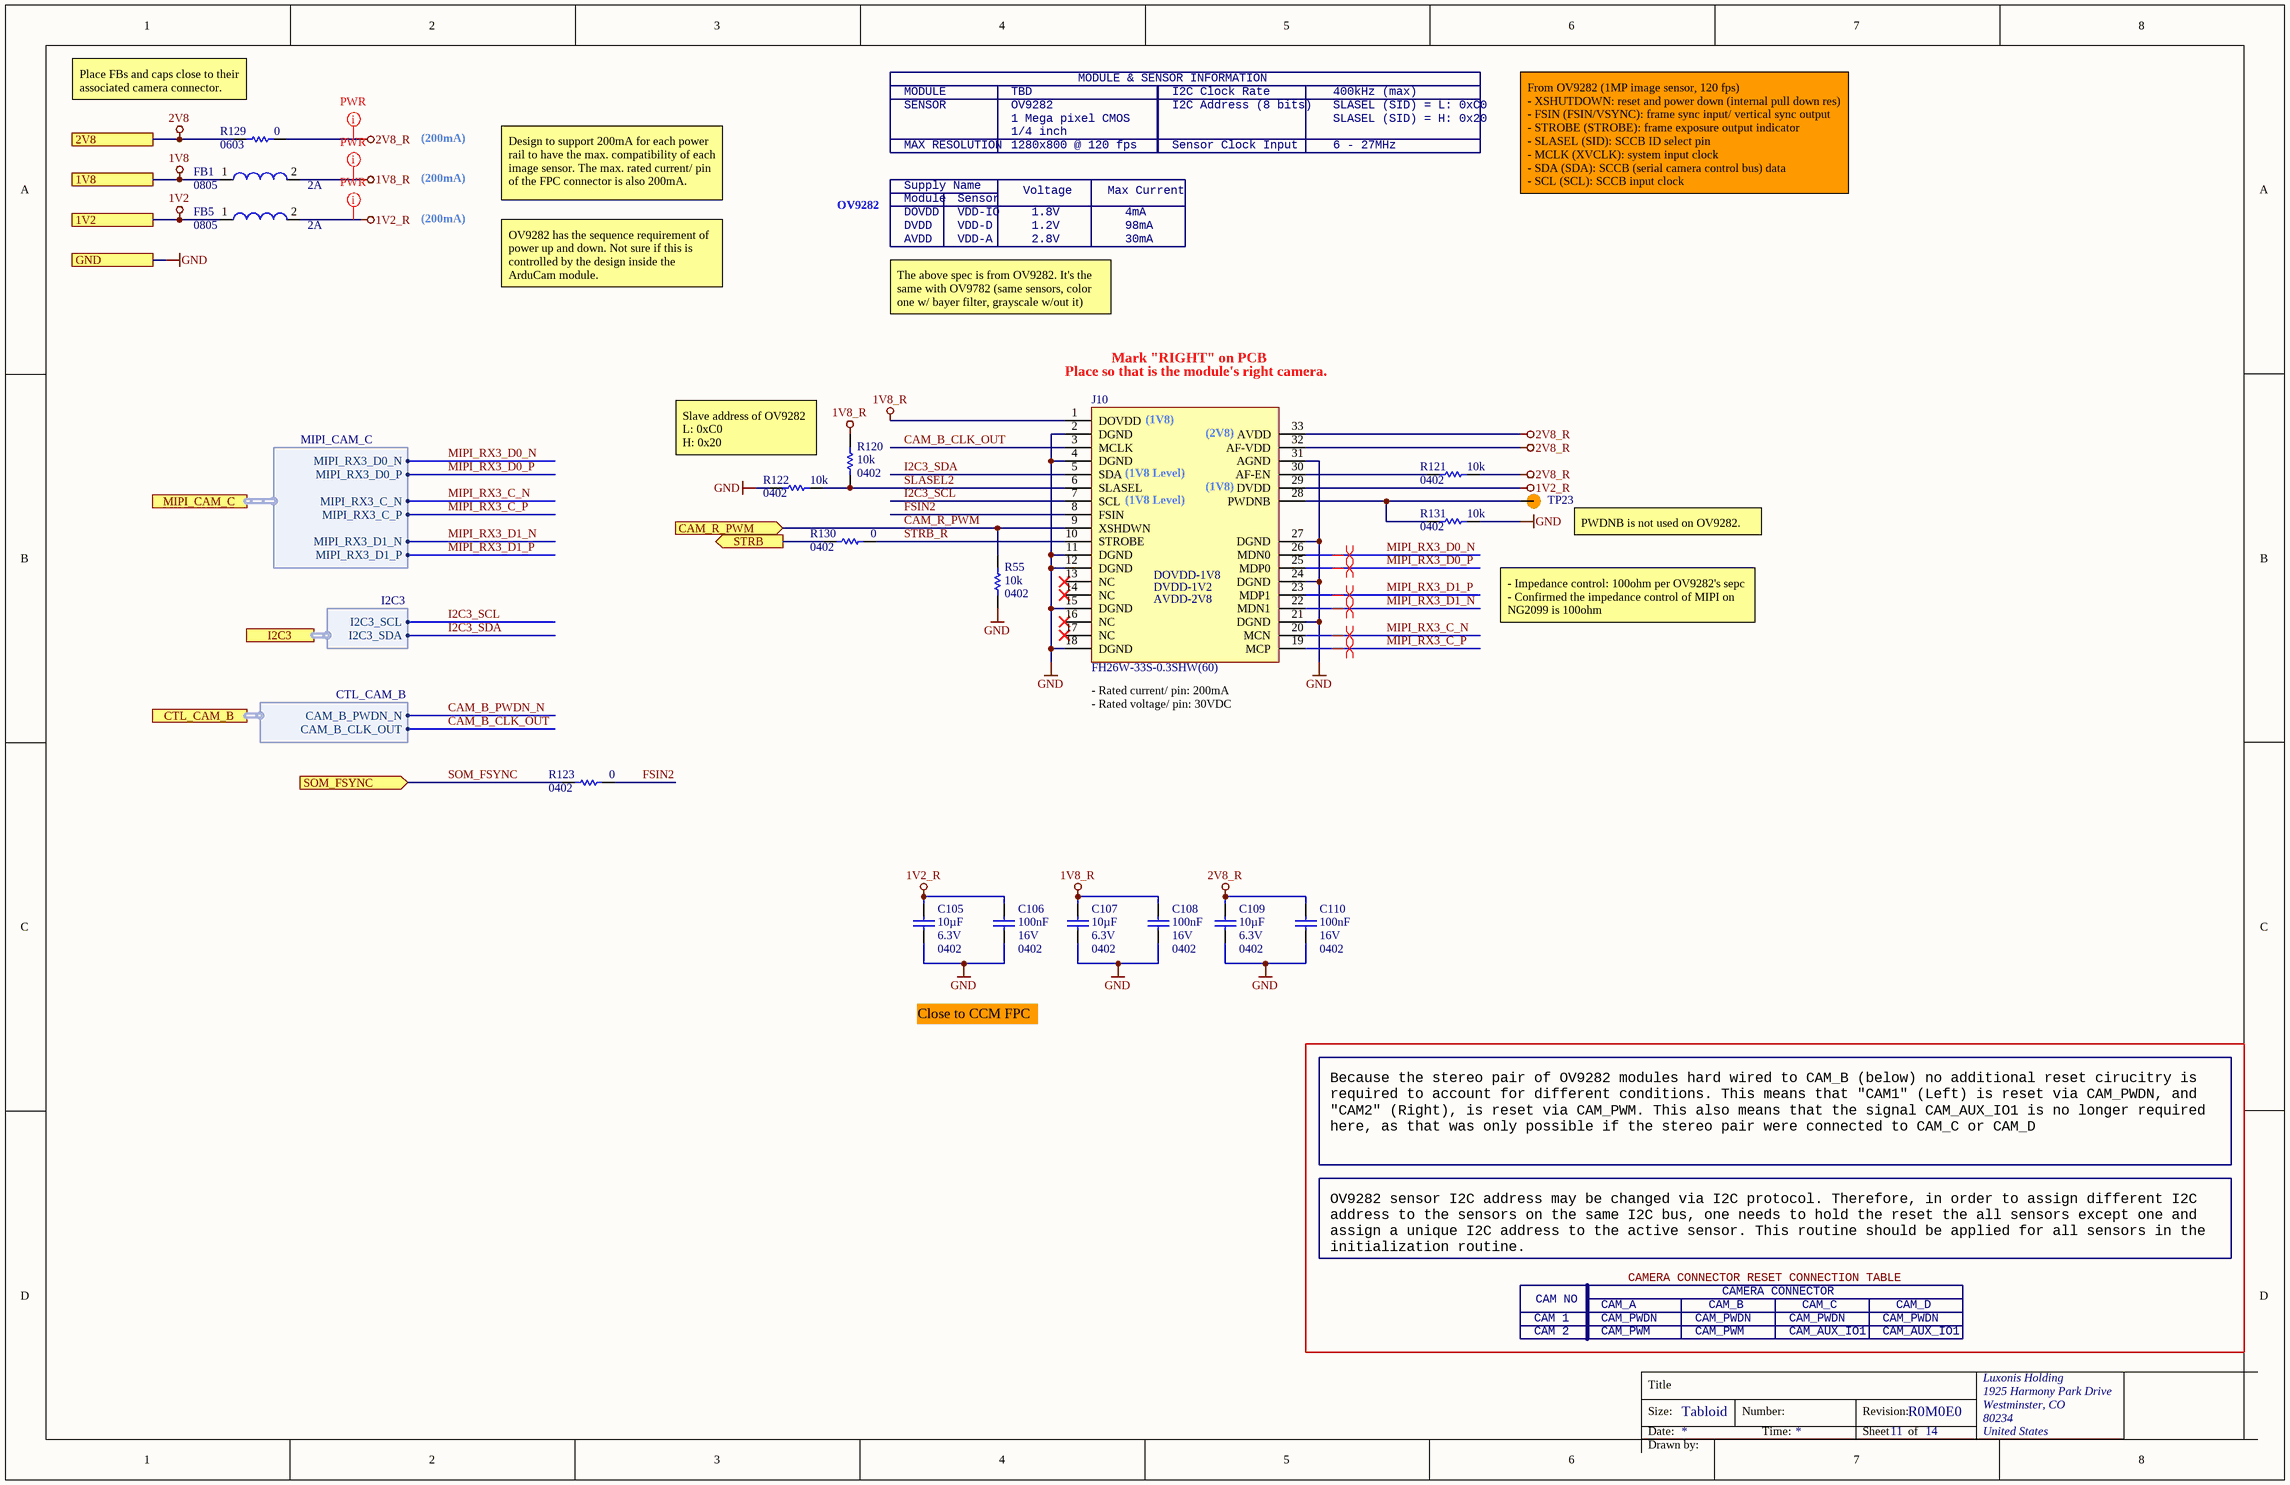
[diagram p8: RIGHT_CCM.SchDoc]

### Parts
C105  value 10µF  Voltage Rating: 6.3V  Case/Package: 0402  [CAPC0402(1005)70_N]  (hidden comment: GRM155R60J106ME15D)
C106  value 100nF  Voltage Rating: 16V  Case/Package: 0402  [CAPC0402(1005)60_N]  (hidden comment: CL05B104KO5NFNC)
C107  value 10µF  Voltage Rating: 6.3V  Case/Package: 0402  [CAPC0402(1005)70_N]  (hidden comment: GRM155R60J106ME15D)
C108  value 100nF  Voltage Rating: 16V  Case/Package: 0402  [CAPC0402(1005)60_N]  (hidden comment: CL05B104KO5NFNC)
C109  value 10µF  Voltage Rating: 6.3V  Case/Package: 0402  [CAPC0402(1005)70_N]  (hidden comment: GRM155R60J106ME15D)
C110  value 100nF  Voltage Rating: 16V  Case/Package: 0402  [CAPC0402(1005)60_N]  (hidden comment: CL05B104KO5NFNC)
FB1  Current Rating: 2A  Case/Package: 0805  [2508056017Y2]  (hidden comment: 2508056017Y2)
FB5  Current Rating: 2A  Case/Package: 0805  [2508056017Y2]  (hidden comment: 2508056017Y2)
J10  FH26W-33S-0.3SHW(60)  [AC-PY003-OV9282]
R55  value 10k  Case/Package: 0402  [RESC0402(1005)_N]  (hidden comment: RC0402FR-1310KL)
R120  value 10k  Case/Package: 0402  [RESC0402(1005)_N]  (hidden comment: RC0402FR-1310KL)
R121  value 10k  Case/Package: 0402  [RESC0402(1005)_N]  (hidden comment: RC0402FR-1310KL)
R122  value 10k  Case/Package: 0402  [RESC0402(1005)_N]  (hidden comment: RC0402FR-1310KL)
R123  value 0  Case/Package: 0402  [RESC0402(1005)_L]  (hidden comment: CRCW04020000Z0ED)
R129  value 0  Case/Package: 0603  [RESC0603(1608)_N]  (hidden comment: CRCW06030000Z0EA)
R130  value 0  Case/Package: 0402  [RESC0402(1005)_L]  (hidden comment: CRCW04020000Z0ED)
R131  value 10k  Case/Package: 0402  [RESC0402(1005)_N]  (hidden comment: RC0402FR-1310KL)
TP23  TP075_150_NS  [TP075_150_NS]  (value not drawn)  (no BOM)

### Ports
1V2, 1V8, 2V8, CAM_R_PWM (in), CTL_CAM_B (harness CTL_CAM_B), GND, I2C3 (harness I2C3), MIPI_CAM_C (harness MIPI_CAM_C), SOM_FSYNC (in), STRB (out)

### Harnesses
MIPI_CAM_C: MIPI_RX3_D1_P, MIPI_RX3_D1_N, MIPI_RX3_D0_N, MIPI_RX3_D0_P, MIPI_RX3_C_N, MIPI_RX3_C_P
I2C3: I2C3_SDA, I2C3_SCL
CTL_CAM_B: CAM_B_PWDN_N, CAM_B_CLK_OUT

### Nets
1V2: FB5.1 ; port 1V2
1V2_R: C105.2 C106.2 FB5.2 J10.29(DVDD)
1V8: FB1.1 ; port 1V8
1V8_R: C107.2 C108.2 FB1.2 J10.1(DOVDD) R120.2
2V8: R129.1 ; port 2V8
2V8_R: C109.2 C110.2 J10.32(AF-VDD) J10.33(AVDD) R121.2 R129.2
GND: C105.1 C106.1 C107.1 C108.1 C109.1 C110.1 J10.2(DGND) J10.4(DGND) J10.11(DGND) J10.12(DGND) J10.15(DGND) J10.18(DGND) J10.21(DGND) J10.24(DGND) J10.27(DGND) J10.31(AGND) R55.1 R122.1 R131.2 ; port GND
CAM_B_CLK_OUT: J10.3(MCLK) ; port CTL_CAM_B.CAM_B_CLK_OUT
CAM_R_PWM: J10.9(XSHDWN) R55.2 ; port CAM_R_PWM
FSIN2: J10.8(FSIN) R123.1
I2C3_SCL: J10.7(SCL) ; port I2C3.I2C3_SCL
I2C3_SDA: J10.5(SDA) ; port I2C3.I2C3_SDA
MIPI_RX3_C_N: J10.20(MCN) ; port MIPI_CAM_C.MIPI_RX3_C_N
MIPI_RX3_C_P: J10.19(MCP) ; port MIPI_CAM_C.MIPI_RX3_C_P
MIPI_RX3_D0_N: J10.26(MDN0) ; port MIPI_CAM_C.MIPI_RX3_D0_N
MIPI_RX3_D0_P: J10.25(MDP0) ; port MIPI_CAM_C.MIPI_RX3_D0_P
MIPI_RX3_D1_N: J10.22(MDN1) ; port MIPI_CAM_C.MIPI_RX3_D1_N
MIPI_RX3_D1_P: J10.23(MDP1) ; port MIPI_CAM_C.MIPI_RX3_D1_P
SLASEL2: J10.6(SLASEL) R120.1 R122.2
SOM_FSYNC: R123.2 ; port SOM_FSYNC
STRB: R130.2 ; port STRB
STRB_R: J10.10(STROBE) R130.1
NetJ10_28: J10.28(PWDNB) R131.1 TP23.1
NetJ10_30: J10.30(AF-EN) R121.1

Not connected (* = marked no-connect by the designer): J10 13(NC)* 14(NC)* 16(NC)* 17(NC)*

### Layout directives
differential pair; net class MIPI; differential pair class 100ohm: MIPI_RX3_C_N, MIPI_RX3_C_P, MIPI_RX3_D0_N, MIPI_RX3_D0_P, MIPI_RX3_D1_N, MIPI_RX3_D1_P
net class PWR; Current Rating: 200mA: 1V2_R, 1V8_R, 2V8_R

### Notes on the sheet
- (near R129) Place FBs and caps close to their associated camera connector.
- MODULE
- TBD
- MODULE & SENSOR INFORMATION
- I2C Clock Rate
- 400kHz (max)
- (200mA)
- SENSOR
- MAX RESOLUTION
- 1 Mega pixel CMOS
- 1280x800 @ 120 fps
- OV9282
- 1/4 inch
- I2C Address (8 bits)
- Sensor Clock Input
- SLASEL (SID) = L: 0xC0
- SLASEL (SID) = H: 0x20
- 6 - 27MHz
- Design to support 200mA for each power rail to have the max. compatibility of each image sensor. The max. rated current/ pin of the FPC connector is also 200mA.
- DOVDD
- DVDD
- Supply Name
- Module
- VDD-IO
- VDD-D
- Sensor
- Voltage
- 1.8V
- 1.2V
- Max Current
- 4mA
- 98mA
- From OV9282 (1MP image sensor, 120 fps)
  - XSHUTDOWN: reset and power down (internal pull down res)
  - FSIN (FSIN/VSYNC): frame sync input/ vertical sync output
  - STROBE (STROBE): frame exposure output indicator
  - SLASEL (SID): SCCB ID select pin
  - MCLK (XVCLK): system input clock
  - SDA (SDA): SCCB (serial camera control bus) data
  - SCL (SCL): SCCB input clock
- OV9282 has the sequence requirement of power up and down. Not sure if this is controlled by the design inside the ArduCam module.
- AVDD
- VDD-A
- 2.8V
- 30mA
- The above spec is from OV9282. It's the same with OV9782 (same sensors, color one w/ bayer filter, grayscale w/out it)
- Mark "RIGHT" on PCB
- (near J10) Place so that is the module's right camera.
- (near J10) (1V8)
- (near J10) (2V8)
- Slave address of OV9282
  L: 0xC0
  H: 0x20
- (near J10) (1V8 Level)
- (near TP23) PWDNB is not used on OV9282.
- - Impedance control: 100ohm per OV9282's sepc
  - Confirmed the impedance control of MIPI on NG2099 is 100ohm
- (near J10) - Rated current/ pin: 200mA
  - Rated voltage/ pin: 30VDC
- Close to CCM FPC
- Because the stereo pair of OV9282 modules hard wired to CAM_B (below) no additional reset cirucitry is required to account for different conditions. This means that "CAM1" (Left) is reset via CAM_PWDN, and "CAM2" (Right), is reset via CAM_PWM. This also means that the signal CAM_AUX_IO1 is no longer required here, as that was only possible if the stereo pair were connected to CAM_C or CAM_D
- OV9282 sensor I2C address may be changed via I2C protocol. Therefore, in order to assign different I2C address to the sensors on the same I2C bus, one needs to hold the reset the all sensors except one and assign a unique I2C address to the active sensor. This routine should be applied for all sensors in the initialization routine.
- CAM NO
- CAMERA CONNECTOR RESET CONNECTION TABLE
- CAMERA CONNECTOR
- CAM 1
- CAM 2
- CAM_A
- CAM_PWDN
- CAM_PWM
- CAM_B
- CAM_AUX_IO1
- CAM_C
- CAM_D
- Title
- Size:
- Date:
- Tabloid
- Number:
- Time:
- Revision:
- Sheet
- of
- Drawn by:
- (in symbol AC_PY003-OV9282_CON) DOVDD-1V8; DVDD-1V2; AVDD-2V8

### Library data of the parts
C105 C107 C109 = CMP-004-000009-5: as C56 on sheet TOF_VGA; Dielectric: X5R; Manufacturer Part Number 1: GRM155R60J106ME15D; ComponentLink1URL: https://www.murata.com/~/media/webrenewal/support/library/catalog/products/capacitor/mlcc/c02e.ashx?la=en-us&src-supplier=Digi-Key; Design Item ID: GRM155R60J106ME15D; Tolerance: 20%; Width: 0.02inch; Length: 0.039inch; Mounting Technology: SMT; Min Operating Temperature: -55°C; Max Operating Temperature: 85°C; ComponentLink1Description: https://www.murata.com/~/media/webrenewal/support/library/catalog/products/capacitor/mlcc/c02e.ashx?la=en-us&src-supplier=Digi-Key
C106 C108 C110 = CMP-108-000002-6: as C43 on sheet POWER_GEN; ComponentLink1URL: https://datasheet.ciiva.com/25767/cl05b104ko5nfnc-25767124.pdf?src-supplier=Digi-Key; Length: 1mm; Design Item ID: CL05B104KO5NFNC; Tolerance: 10%; Min Operating Temperature: -55°C; Width: 0.02inch; Dielectric: X7R; ComponentLink1Description: https://datasheet.ciiva.com/25767/cl05b104ko5nfnc-25767124.pdf?src-supplier=Digi-Key; Height: 0.5mm; Depth: 0.5mm; Manufacturer Part Number 1: CL05B104KO5NFNC; Max Operating Temperature: 125°C; Mounting Technology: SMT
FB1 FB5 = CMP-082-000000-2: as FB4 on sheet TOF_VGA; Manufacturer Part Number 1: 2508056017Y2
J10 = AC_PY003-OV9282_CON: FFC/FPC Connector, 33 Contact(s), 1 Row(s), Female, Right Angle, Surface Mount Terminal; Manufacturer 1: Hirose; Supplier 1: Digi-Key; Manufacturer Part Number 1: FH26W-33S-0.3SHW(60); RoHS: Yes; Category: FFC / FPC; Stock 1: 627; Pricing 1: 1=1,78000, 10=1,61700, 25=1,51800, 50=1,45200, 100=1,38600, 250=1,25400, 500=1,15500, 1000=0,99000, 2500=0,92400 (USD); ComponentLink1URL: https://datasheet.ciiva.com:443/pdfs/VipMasterIC/IC/HIRO/HIRO-S-A0007913874/HIRO-S-A0008593114-1.pdf?src-supplier=IHS+Markit; ComponentLink1Description: https://datasheet.ciiva.com:443/pdfs/VipMasterIC/IC/HIRO/HIRO-S-A0007913874/HIRO-S-A0008593114-1.pdf?src-supplier=IHS+Markit; ComponentLink2URL: https://www.hirose.com/product/en/download_file/key_name/FH26/category/Catalog/doc_file_id/49355/?file_category_id=4&item_id=298&is_series=1&src-supplier=Digi-Key; ComponentLink2Description: https://www.hirose.com/product/en/download_file/key_name/FH26/category/Catalog/doc_file_id/49355/?file_category_id=4&item_id=298&is_series=1&src-supplier=Digi-Key; ComponentLink3URL: https://www.hirose.com/product/download/?distributor=digikey&amp;type=2d&amp;lang=en&amp;num=FH26W-13S-0.3SHW(60)&src-supplier=Digi-Key; ComponentLink3Description: https://www.hirose.com/product/download/?distributor=digikey&amp;type=2d&amp;lang=en&amp;num=FH26W-13S-0.3SHW(60)&src-supplier=Digi-Key; Supplier Part Number 1: H125800CT-ND
R55 R120-R122 R131 = CMP-115-000004-8: as R93-R95 on sheet TOF_VGA; Min Operating Temperature: -55°C; Max Operating Temperature: 155°C; Design Item ID: RC0402FR-1310KL; Tolerance: 1%; Manufacturer Part Number 1: RC0402FR-1310KL
R123 R130 = CMP-013-000022-11: as R63 on sheet TOF_VGA; Max Operating Temperature: 155°C; Manufacturer Part Number 1: CRCW04020000Z0ED; Tolerance: 5%; Min Operating Temperature: -55°C; Design Item ID: CRCW04020000Z0ED
R129 = CMP-115-000011-7: as R64 on sheet POWER_GEN; Tolerance: 5%; Design Item ID: CRCW06030000Z0EA; Max Operating Temperature: 155°C; Min Operating Temperature: -55°C
TP23 = TEST_POINT